# EAGLE design v.0.0.2 (EAGLE 5.08)

## Sheet 1 of 6
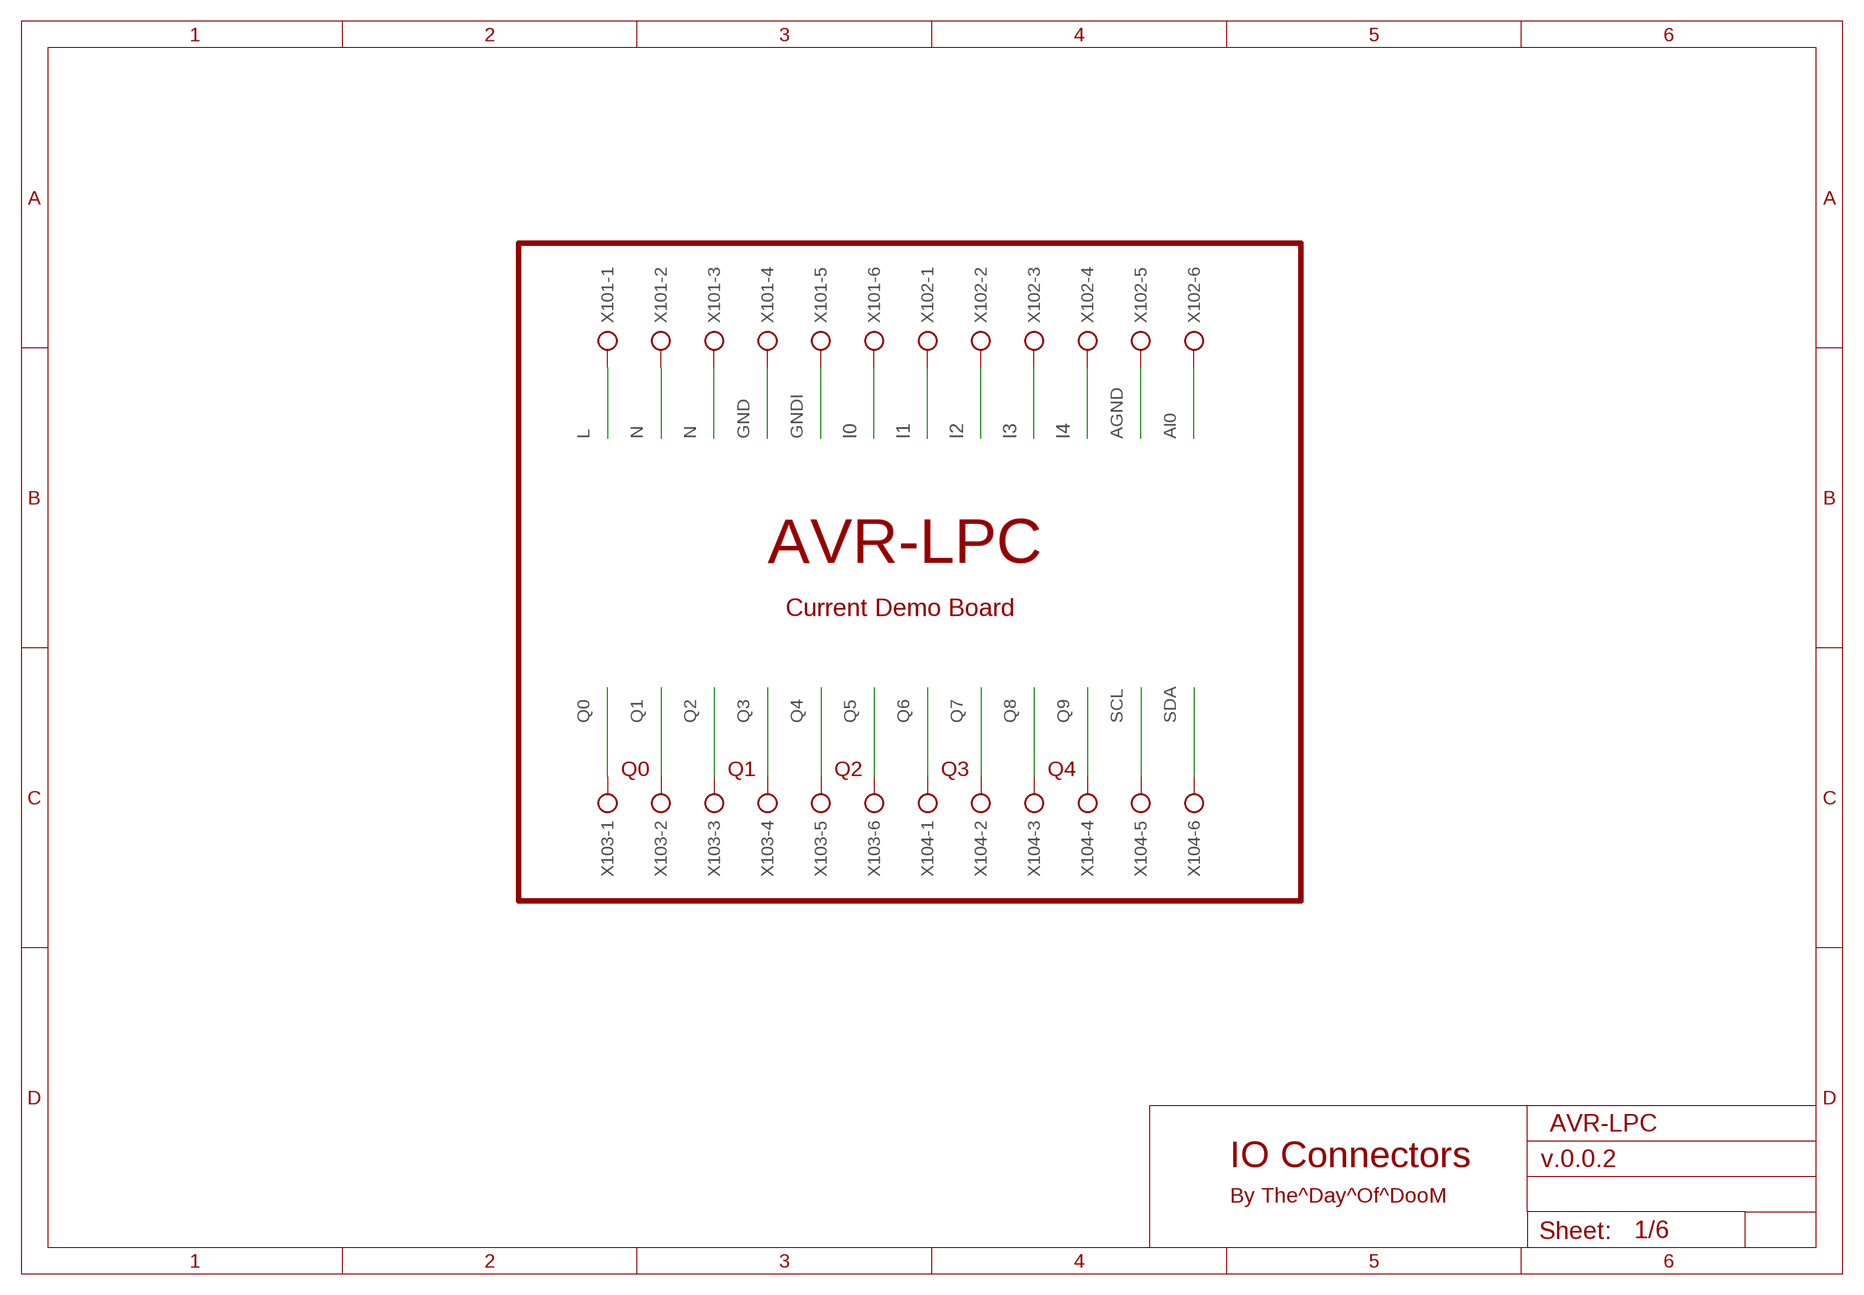
[diagram p0: schematic, sheet 1]

### Parts
X101  AK500/6  [AK500/6]
X102  AK500/6  [AK500/6]
X103  AK500/6  [AK500/6]
X104  AK500/6  [AK500/6]

### Nets
AGND: X102.5 ; also sheet 2,3
AI0: X102.6 ; also sheet 3
GND: X101.4 ; also sheet 2,3,4,5,6
GNDI: X101.5 ; also sheet 2,5
I0: X101.6 ; also sheet 5
I1: X102.1 ; also sheet 5
I2: X102.2 ; also sheet 5
I3: X102.3 ; also sheet 5
I4: X102.4 ; also sheet 5
L: X101.1 ; also sheet 2
N: X101.2 X101.3 ; also sheet 2
Q0: X103.1 ; also sheet 6
Q1: X103.2 ; also sheet 6
Q2: X103.3 ; also sheet 6
Q3: X103.4 ; also sheet 6
Q4: X103.5 ; also sheet 6
Q5: X103.6 ; also sheet 6
Q6: X104.1 ; also sheet 6
Q7: X104.2 ; also sheet 6
Q8: X104.3 ; also sheet 6
Q9: X104.4 ; also sheet 6
SCL: X104.5 ; also sheet 3
SDA: X104.6 ; also sheet 3

### Notes on the sheet
- AVR-LPC
- Current Demo Board
- Q0 | Q1 | Q2 | Q3 | Q4
- AVR-LPC
- IO Connectors
- By The^Day^Of^DooM

## Sheet 2 of 6
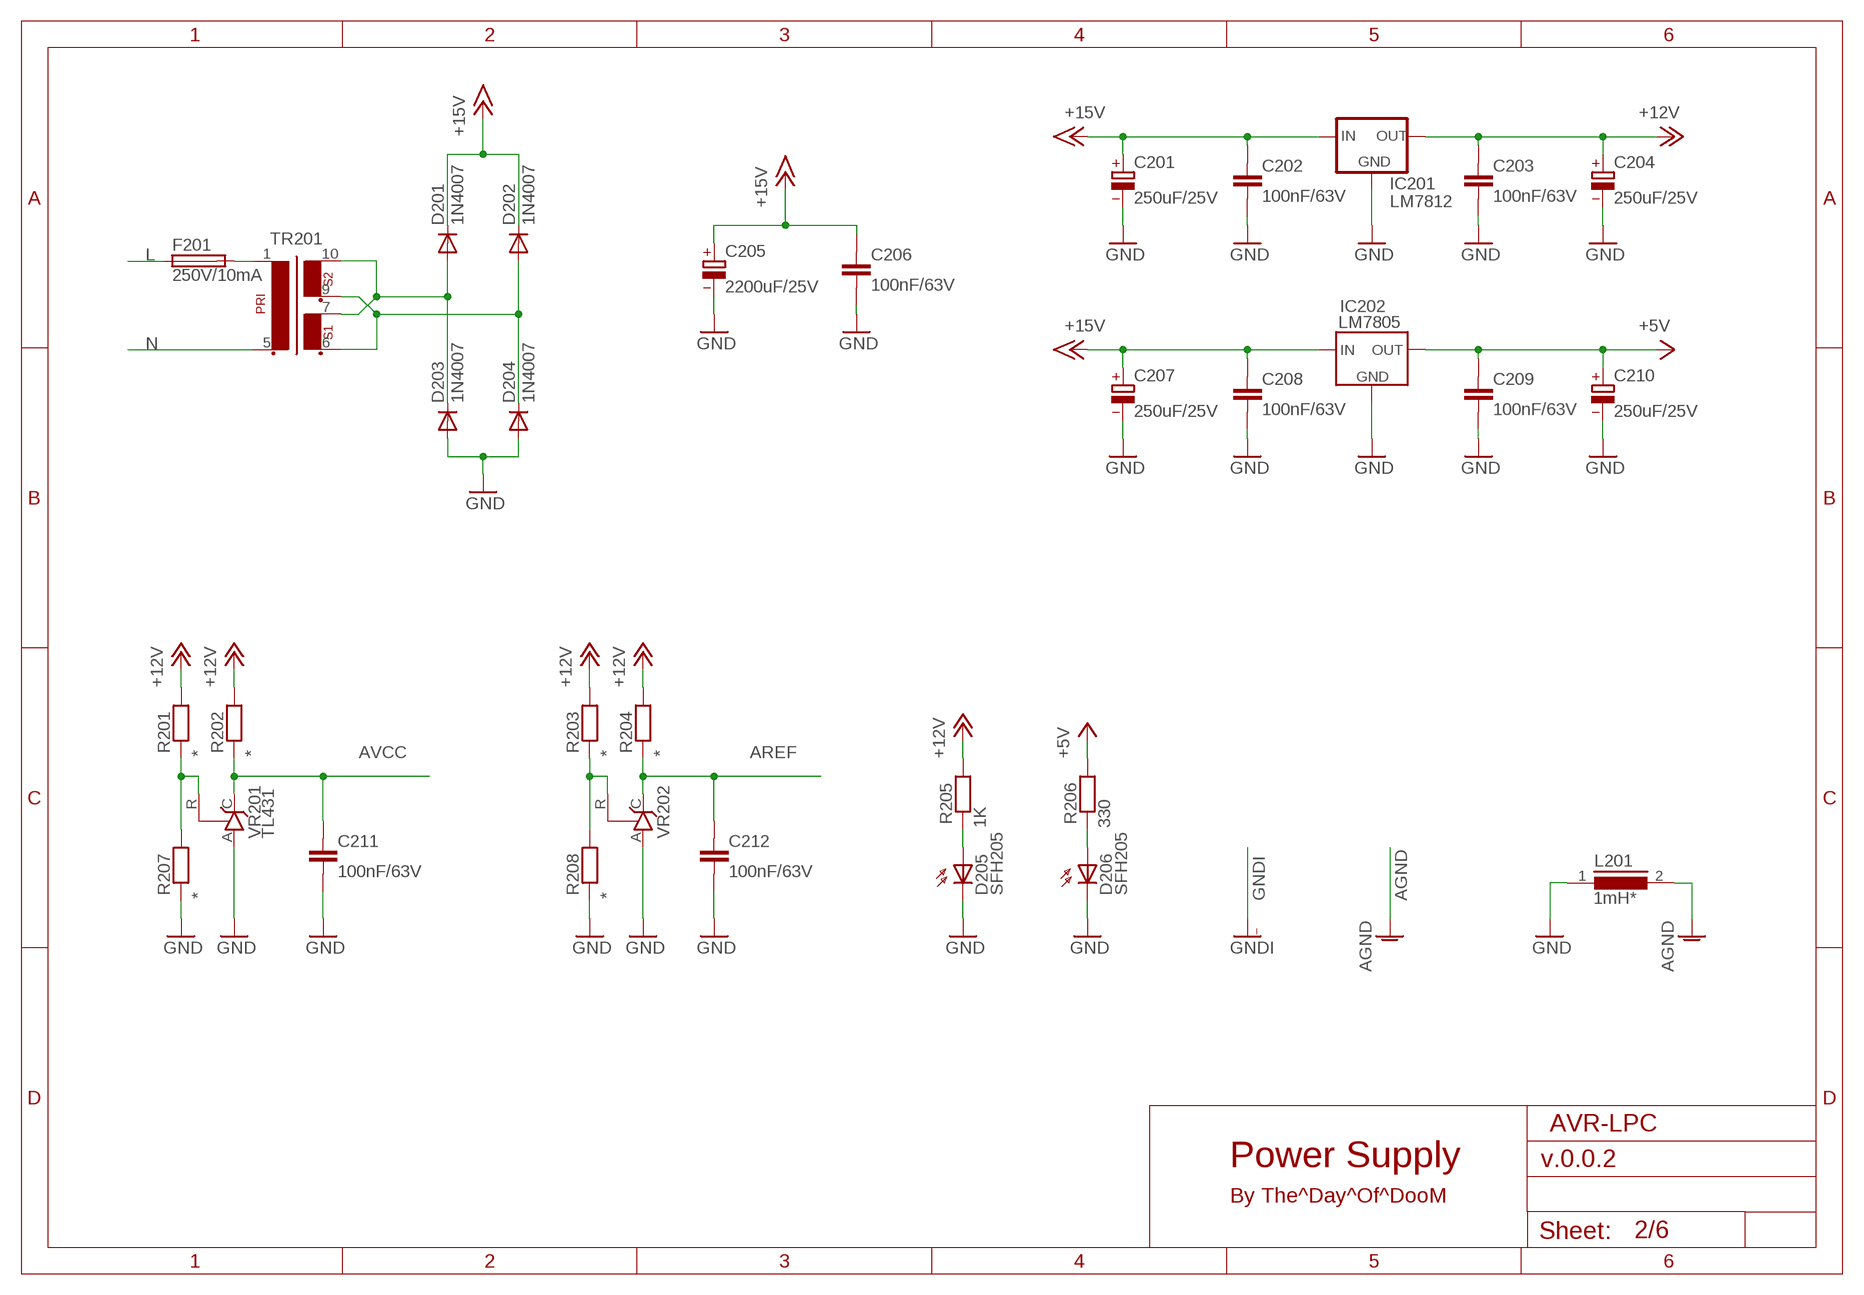
[diagram p1: schematic, sheet 2]

### Parts
C201  250uF/25V  CPOL-EU_Ø250  [CP100X80X24]
C202  100nF/63V  C-EU_2  [C100X86X24]
C203  100nF/63V  C-EU_2  [C100X86X24]
C204  250uF/25V  CPOL-EU_Ø250  [CP100X80X24]
C205  2200uF/25V  CPOL-EU_Ø500Ø400Ø300  [CP500/300X100X24]
C206  100nF/63V  C-EU_3  [C200X100X24]
C207  250uF/25V  CPOL-EU_Ø250  [CP100X80X24]
C208  100nF/63V  C-EU_3  [C200X100X24]
C209  100nF/63V  C-EU_3  [C200X100X24]
C210  250uF/25V  CPOL-EU_Ø250  [CP100X80X24]
C211  100nF/63V  C-EU_3  [C200X100X24]
C212  100nF/63V  C-EU_3  [C200X100X24]
D201  1N4007  1N4007H  [400X100]
D202  1N4007  1N4007H  [400X100]
D203  1N4007  1N4007H  [400X100]
D204  1N4007  1N4007H  [400X100]
D205  SFH205  [SFH205]
D206  SFH205  [SFH205]
F201  250V/10mA  GSH15  [GSH15]
IC201  LM7812  78LXX  [78LXX]
IC202  LM7805  78XXSC1  [78XX_VERTICAL_COOLER]
L201  1mH*  MICC12  [MICC12]
R201  *  R-EU_2  [R100X86X24]
R202  *  R-EU_2  [R100X86X24]
R203  *  R-EU_2  [R100X86X24]
R204  *  R-EU_2  [R100X86X24]
R205  1K  R-EU_3  [R200X86X24]
R206  330  R-EU_3  [R200X86X24]
R207  *  R-EU_2  [R100X86X24]
R208  *  R-EU_2  [R100X86X24]
TR201  EI38-2  [EI38-2]
VR201  TL431  TL431CLP  [TO92-CLP]
VR202  TL431CLP  [TO92-CLP]

### Nets
+5V: C209.P$1 C210.+ IC202.OUT R206.P$2 ; also sheet 3,4,5
+12V: C203.P$1 C204.+ IC201.OUT R201.P$2 R202.P$2 R203.P$2 R204.P$2 R205.P$2 ; also sheet 3
+15V: C201.+ C202.P$1 C205.+ C206.P$1 C207.+ C208.P$1 D201.C D202.C IC201.IN IC202.IN ; also sheet 6
AGND: L201.2 ; also sheet 1,3
AREF: C212.P$1 R204.P$1 VR202.C ; also sheet 3
AVCC: C211.P$1 R202.P$1 VR201.C ; also sheet 3
GND: C201.- C202.P$2 C203.P$2 C204.- C205.- C206.P$2 C207.- C208.P$2 C209.P$2 C210.- C211.P$2 C212.P$2 D203.A D204.A D205.K(C) D206.K(C) IC201.GND IC202.GND L201.1 R207.P$1 R208.P$1 VR201.A VR202.A ; also sheet 1,3,4,5,6
L: F201.1 ; also sheet 1
N: TR201.5 ; also sheet 1
N$1: F201.2 TR201.1
N$3: R201.P$1 R207.P$2 VR201.R
N$5: D202.A D204.C TR201.6 TR201.9
N$6: D201.A D203.C TR201.7 TR201.10
N$7: R203.P$1 R208.P$2 VR202.R
N$20: D205.A R205.P$1
N$34: D206.A R206.P$1

### Notes on the sheet
- AVR-LPC
- Power Supply
- By The^Day^Of^DooM

## Sheet 3 of 6
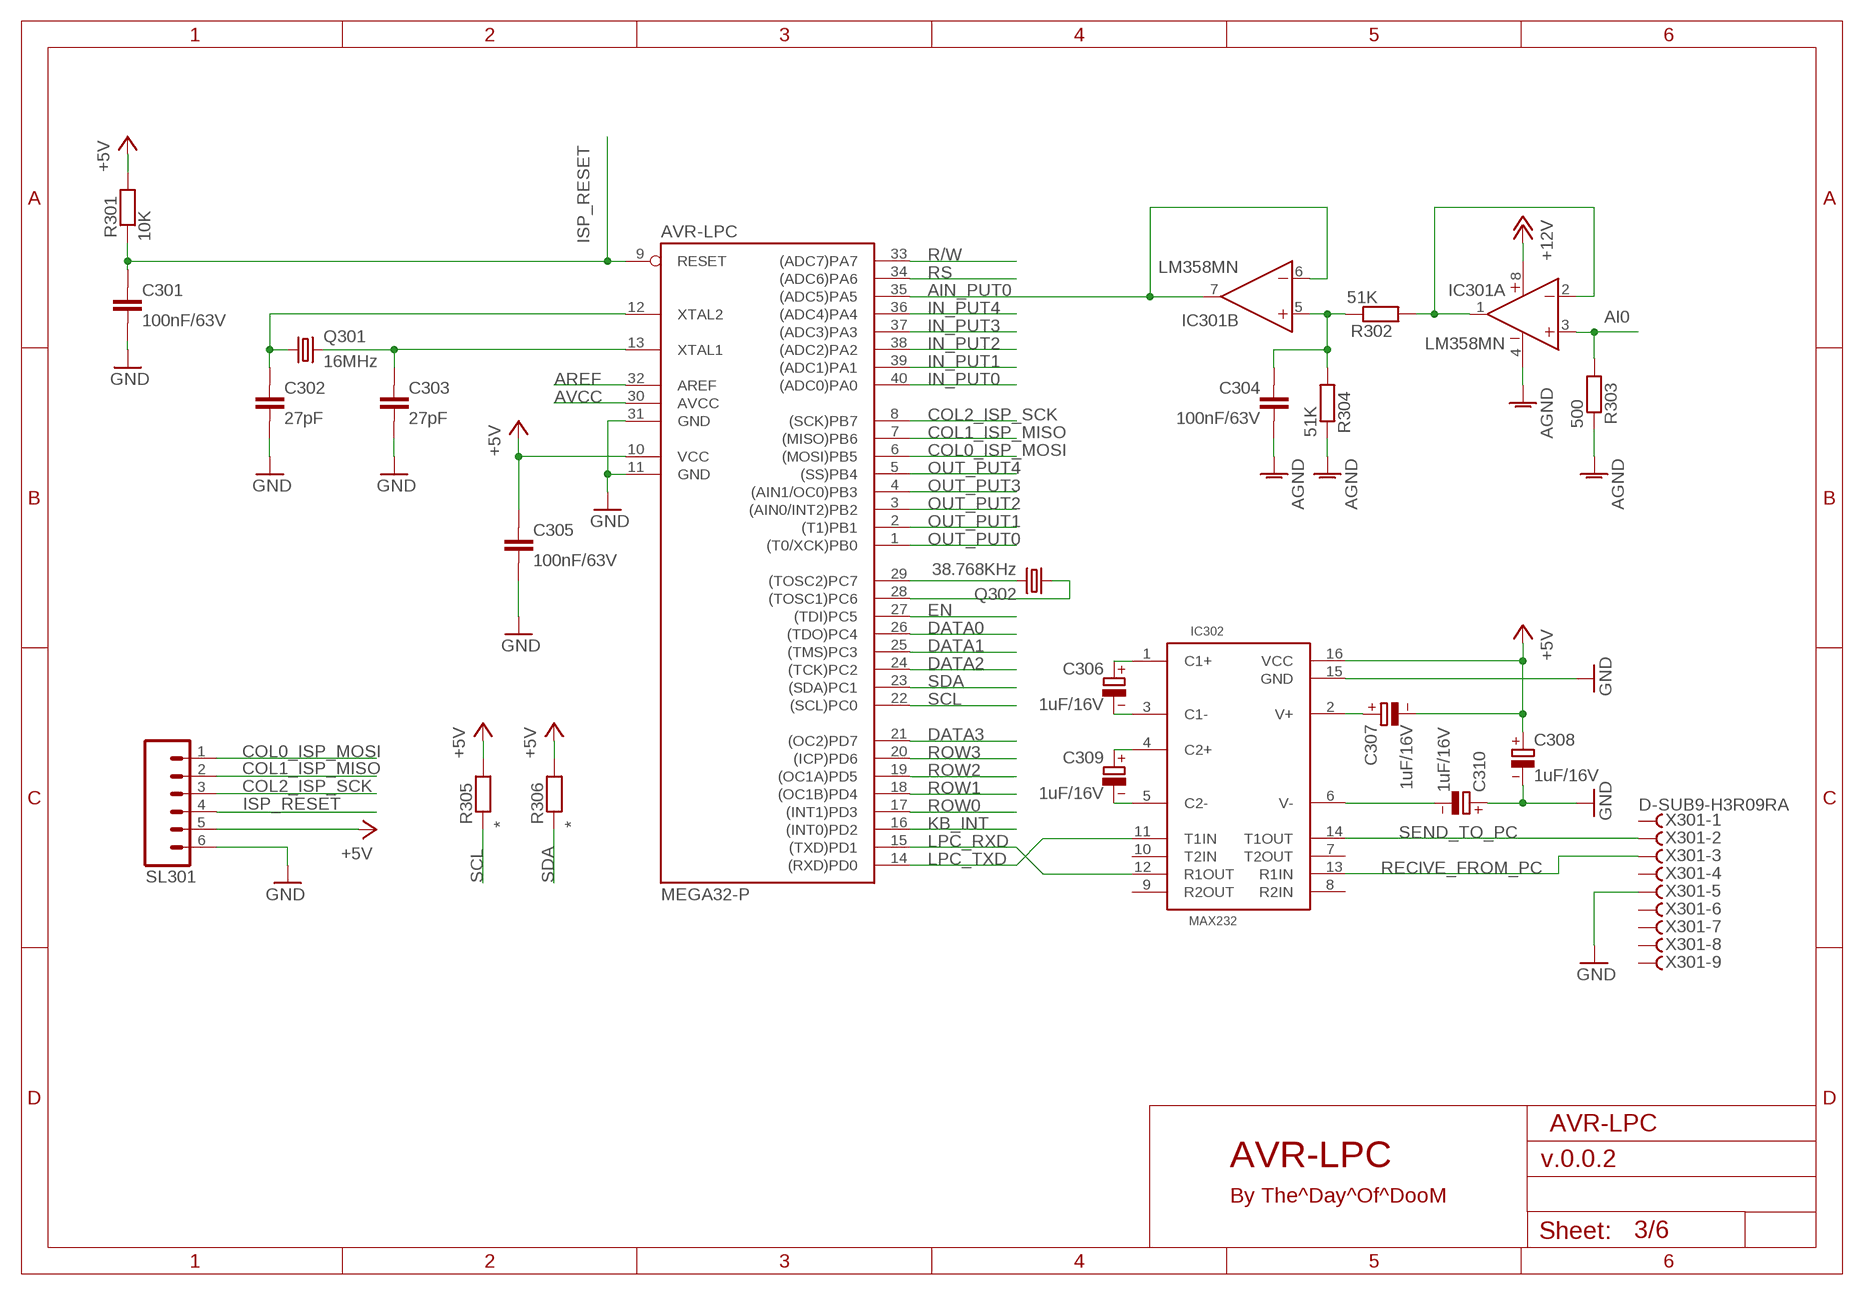
[diagram p2: schematic, sheet 3]

### Parts
AVR-LPC  MEGA32-P  [DIL40]
C301  100nF/63V  C-EU_3  [C200X100X24]
C302  27pF  C-EU_2  [C100X86X24]
C303  27pF  C-EU_2  [C100X86X24]
C304  100nF/63V  C-EU_3  [C200X100X24]
C305  100nF/63V  C-EU_3  [C200X100X24]
C306  1uF/16V  CPOL-EU_Ø250  [CP100X80X24]
C307  1uF/16V  CPOL-EU_Ø250  [CP100X80X24]
C308  1uF/16V  CPOL-EU_Ø250  [CP100X80X24]
C309  1uF/16V  CPOL-EU_Ø250  [CP100X80X24]
C310  1uF/16V  CPOL-EU_Ø250  [CP100X80X24]
IC301  LM358MN  [DIL8]
IC302  MAX232  [DIL16]
Q301  16MHz  CRYSTALHC49U-V  [HC49U-V]
Q302  38.768KHz  CRYSTALTC26V  [TC26V]
R301  10K  R-EU_2  [R100X86X24]
R302  51K  R-EU_5  [R300X100X24]
R303  500  R-EU_2  [R100X86X24]
R304  51K  R-EU_5  [R300X100X24]
R305  *  R-EU_6  [R400X100X24]
R306  *  R-EU_6  [R400X100X24]
SL301  M06  [06P]
X301  D-SUB9-H3R09RA  [H3R09RA]

### Nets
+5V: AVR-LPC.10(VCC) C305.P$1 C307.- C308.+ IC302.16(VCC) R301.P$2 R305.P$2 R306.P$2 SL301.5 ; also sheet 2,4,5
+12V: IC301.8(A:V+) ; also sheet 2
AGND: C304.P$2 IC301.4(A:V-) R303.P$1 R304.P$1 ; also sheet 1,2
AI0: IC301.3(A:IN+) R303.P$2 ; also sheet 1
AIN_PUT0: AVR-LPC.35((ADC5)PA5) IC301.6(B:-IN) IC301.7(B:OUT)
AREF: AVR-LPC.32(AREF) ; also sheet 2
AVCC: AVR-LPC.30(AVCC) ; also sheet 2
COL0_ISP_MOSI: AVR-LPC.6((MOSI)PB5) SL301.1 ; also sheet 4
COL1_ISP_MISO: AVR-LPC.7((MISO)PB6) SL301.2 ; also sheet 4
COL2_ISP_SCK: AVR-LPC.8((SCK)PB7) SL301.3 ; also sheet 4
DATA0: AVR-LPC.26((TDO)PC4) ; also sheet 4
DATA1: AVR-LPC.25((TMS)PC3) ; also sheet 4
DATA2: AVR-LPC.24((TCK)PC2) ; also sheet 4
DATA3: AVR-LPC.21((OC2)PD7) ; also sheet 4
EN: AVR-LPC.27((TDI)PC5) ; also sheet 4
GND: AVR-LPC.11(GND) AVR-LPC.31(GND) C301.P$2 C302.P$2 C303.P$2 C305.P$2 C308.- C310.+ IC302.15(GND) SL301.6 X301.5 ; also sheet 1,2,4,5,6
IN_PUT0: AVR-LPC.40((ADC0)PA0) ; also sheet 5
IN_PUT1: AVR-LPC.39((ADC1)PA1) ; also sheet 5
IN_PUT2: AVR-LPC.38((ADC2)PA2) ; also sheet 5
IN_PUT3: AVR-LPC.37((ADC3)PA3) ; also sheet 5
IN_PUT4: AVR-LPC.36((ADC4)PA4) ; also sheet 5
ISP_RESET: AVR-LPC.9(RESET) C301.P$1 R301.P$1 SL301.4
KB_INT: AVR-LPC.16((INT0)PD2) ; also sheet 4
LPC_RXD: AVR-LPC.15((TXD)PD1) IC302.12(R1OUT)
LPC_TXD: AVR-LPC.14((RXD)PD0) IC302.11(T1IN)
N$4: C306.- IC302.3(C1-)
N$9: C306.+ IC302.1(C1+)
N$10: AVR-LPC.12(XTAL2) C302.P$1 Q301.1
N$11: AVR-LPC.13(XTAL1) C303.P$1 Q301.2
N$12: C309.- IC302.5(C2-)
N$13: C309.+ IC302.4(C2+)
N$14: C307.+ IC302.2(V+)
N$15: AVR-LPC.28((TOSC1)PC6) Q302.1
N$16: AVR-LPC.29((TOSC2)PC7) Q302.2
N$17: C304.P$1 IC301.5(B:IN+) R302.P$1 R304.P$2
N$19: C310.- IC302.6(V-)
N$29: IC301.1(A:OUT) IC301.2(A:IN-) R302.P$2
OUT_PUT0: AVR-LPC.1((T0/XCK)PB0) ; also sheet 6
OUT_PUT1: AVR-LPC.2((T1)PB1) ; also sheet 6
OUT_PUT2: AVR-LPC.3((AIN0/INT2)PB2) ; also sheet 6
OUT_PUT3: AVR-LPC.4((AIN1/OC0)PB3) ; also sheet 6
OUT_PUT4: AVR-LPC.5((SS)PB4) ; also sheet 6
R/W: AVR-LPC.33((ADC7)PA7) ; also sheet 4
RECIVE_FROM_PC: IC302.13(R1IN) X301.3
ROW0: AVR-LPC.17((INT1)PD3) ; also sheet 4
ROW1: AVR-LPC.18((OC1B)PD4) ; also sheet 4
ROW2: AVR-LPC.19((OC1A)PD5) ; also sheet 4
ROW3: AVR-LPC.20((ICP)PD6) ; also sheet 4
RS: AVR-LPC.34((ADC6)PA6) ; also sheet 4
SCL: AVR-LPC.22((SCL)PC0) R305.P$1 ; also sheet 1
SDA: AVR-LPC.23((SDA)PC1) R306.P$1 ; also sheet 1
SEND_TO_PC: IC302.14(T1OUT) X301.2
Unconnected: IC302.7(T2OUT) IC302.8(R2IN) IC302.9(R2OUT) IC302.10(T2IN) X301.1 X301.4 X301.6 X301.7 X301.8 X301.9

### Notes on the sheet
- AVR-LPC
- AVR-LPC
- By The^Day^Of^DooM

## Sheet 4 of 6
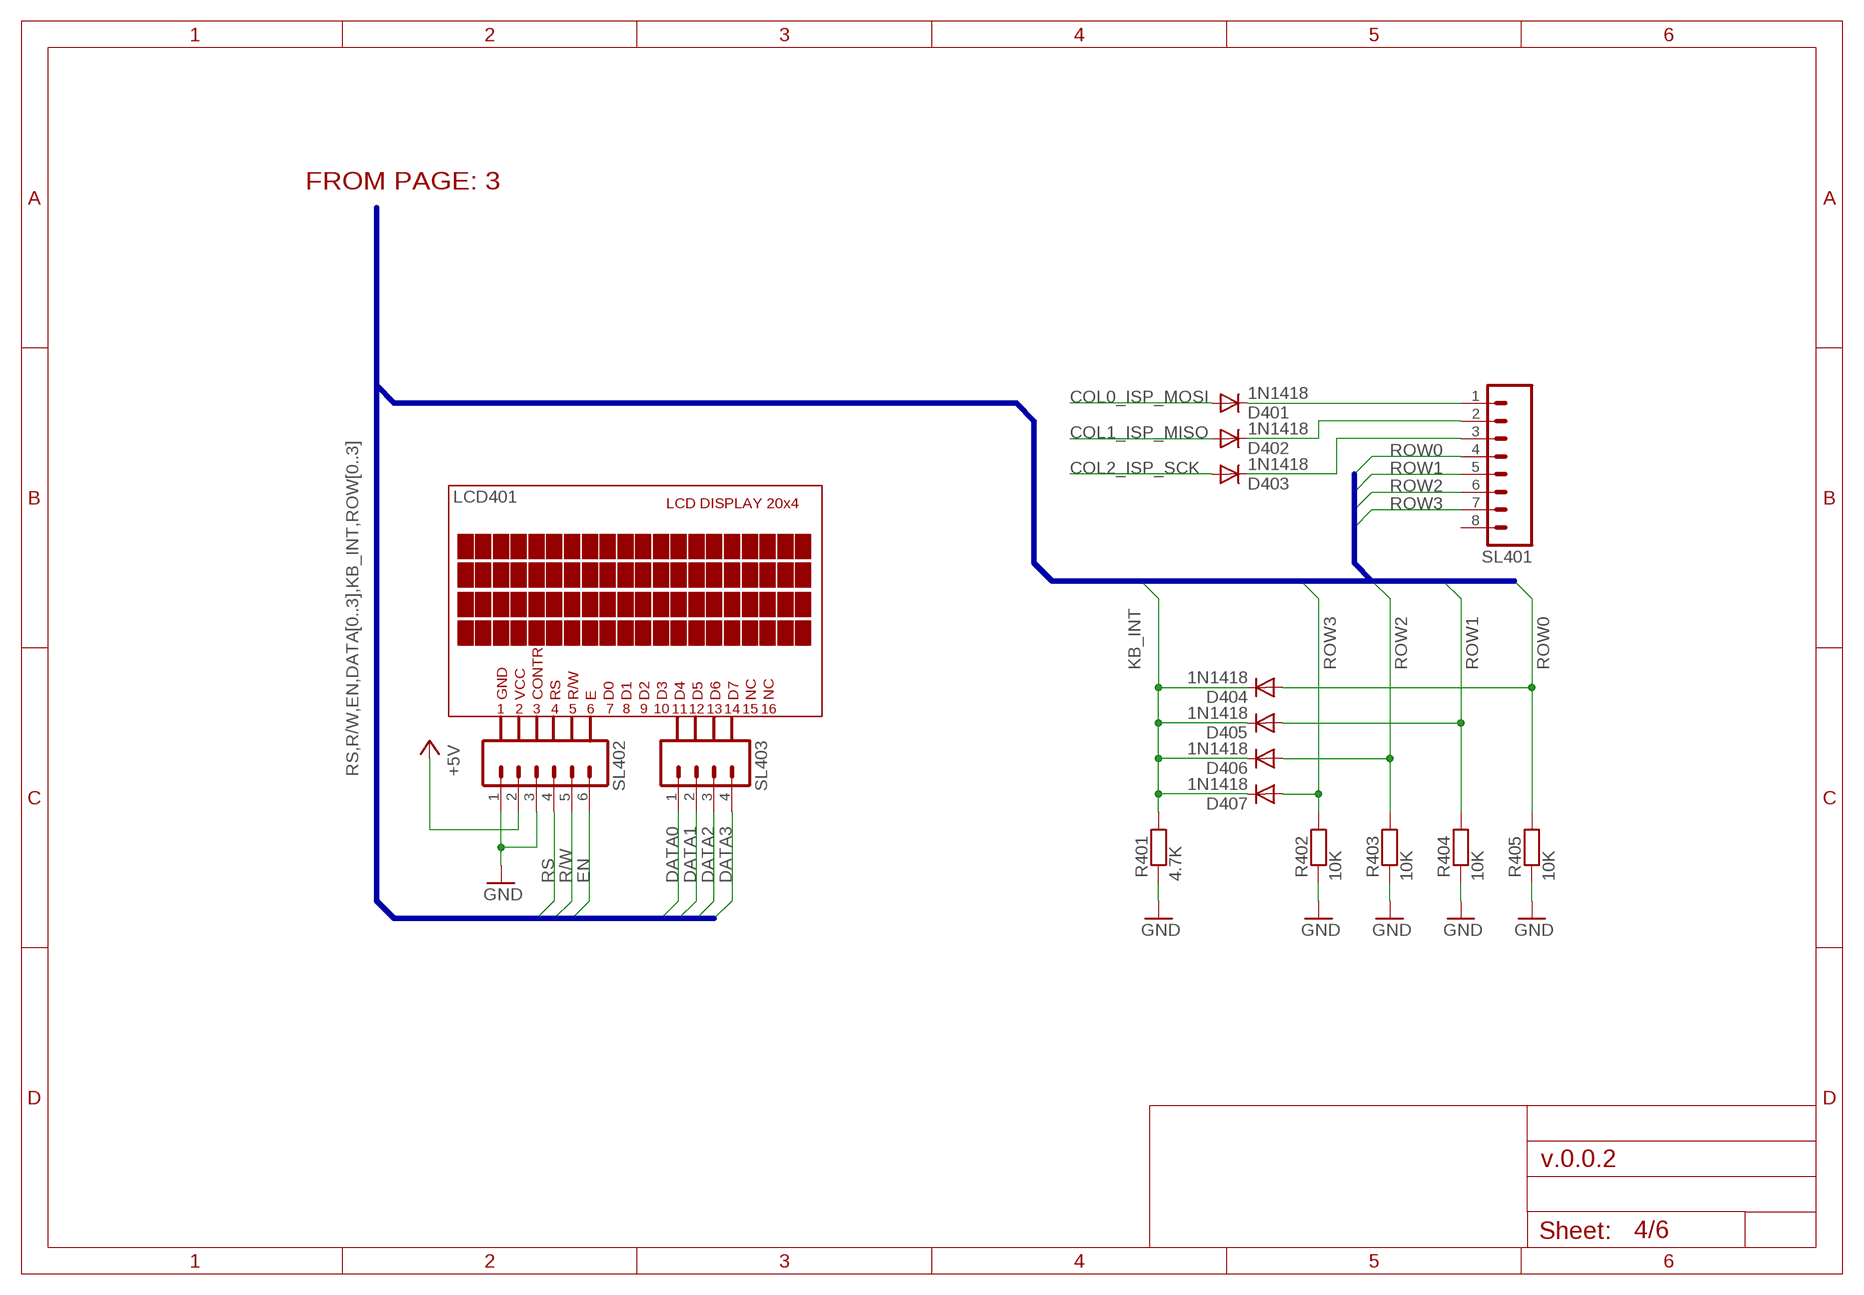
[diagram p3: schematic, sheet 4]

### Parts
D401  1N1418  DIODE-D-5  [D-5]
D402  1N1418  DIODE-D-5  [D-5]
D403  1N1418  DIODE-D-5  [D-5]
D404  1N1418  DIODE-D-2.5  [D-2.5]
D405  1N1418  DIODE-D-2.5  [D-2.5]
D406  1N1418  DIODE-D-2.5  [D-2.5]
D407  1N1418  DIODE-D-2.5  [D-2.5]
LCD401  JM204_SIZESIZE  [JM20X4]
R401  4.7K  R-EU_9  [R300X86X24]
R402  10K  R-EU_10  [R350X86X24]
R403  10K  R-EU_10  [R350X86X24]
R404  10K  R-EU_10  [R350X86X24]
R405  10K  R-EU_10  [R350X86X24]
SL401  M08  [08P]
SL402  M06  [06P]
SL403  M04  [04P]

### Nets
+5V: SL402.2 ; also sheet 2,3,5
COL0_ISP_MOSI: D401.A ; also sheet 3
COL1_ISP_MISO: D402.A ; also sheet 3
COL2_ISP_SCK: D403.A ; also sheet 3
DATA0: SL403.1 ; also sheet 3
DATA1: SL403.2 ; also sheet 3
DATA2: SL403.3 ; also sheet 3
DATA3: SL403.4 ; also sheet 3
EN: SL402.6 ; also sheet 3
GND: R401.P$1 R402.P$1 R403.P$1 R404.P$1 R405.P$1 SL402.1 SL402.3 ; also sheet 1,2,3,5,6
KB_INT: D404.C D405.C D406.C D407.C R401.P$2 ; also sheet 3
N$24: D401.C SL401.1
N$25: D402.C SL401.2
N$28: D403.C SL401.3
R/W: SL402.5 ; also sheet 3
ROW0: D404.A R405.P$2 SL401.4 ; also sheet 3
ROW1: D405.A R404.P$2 SL401.5 ; also sheet 3
ROW2: D406.A R403.P$2 SL401.6 ; also sheet 3
ROW3: D407.A R402.P$2 SL401.7 ; also sheet 3
RS: SL402.4 ; also sheet 3
Unconnected: SL401.8

### Buses
RS,R/W,EN,DATA[0..3],KB_INT,ROW[0..3]
KB_INT,ROW[0..3]

### Notes on the sheet
- FROM PAGE: 3

## Sheet 5 of 6
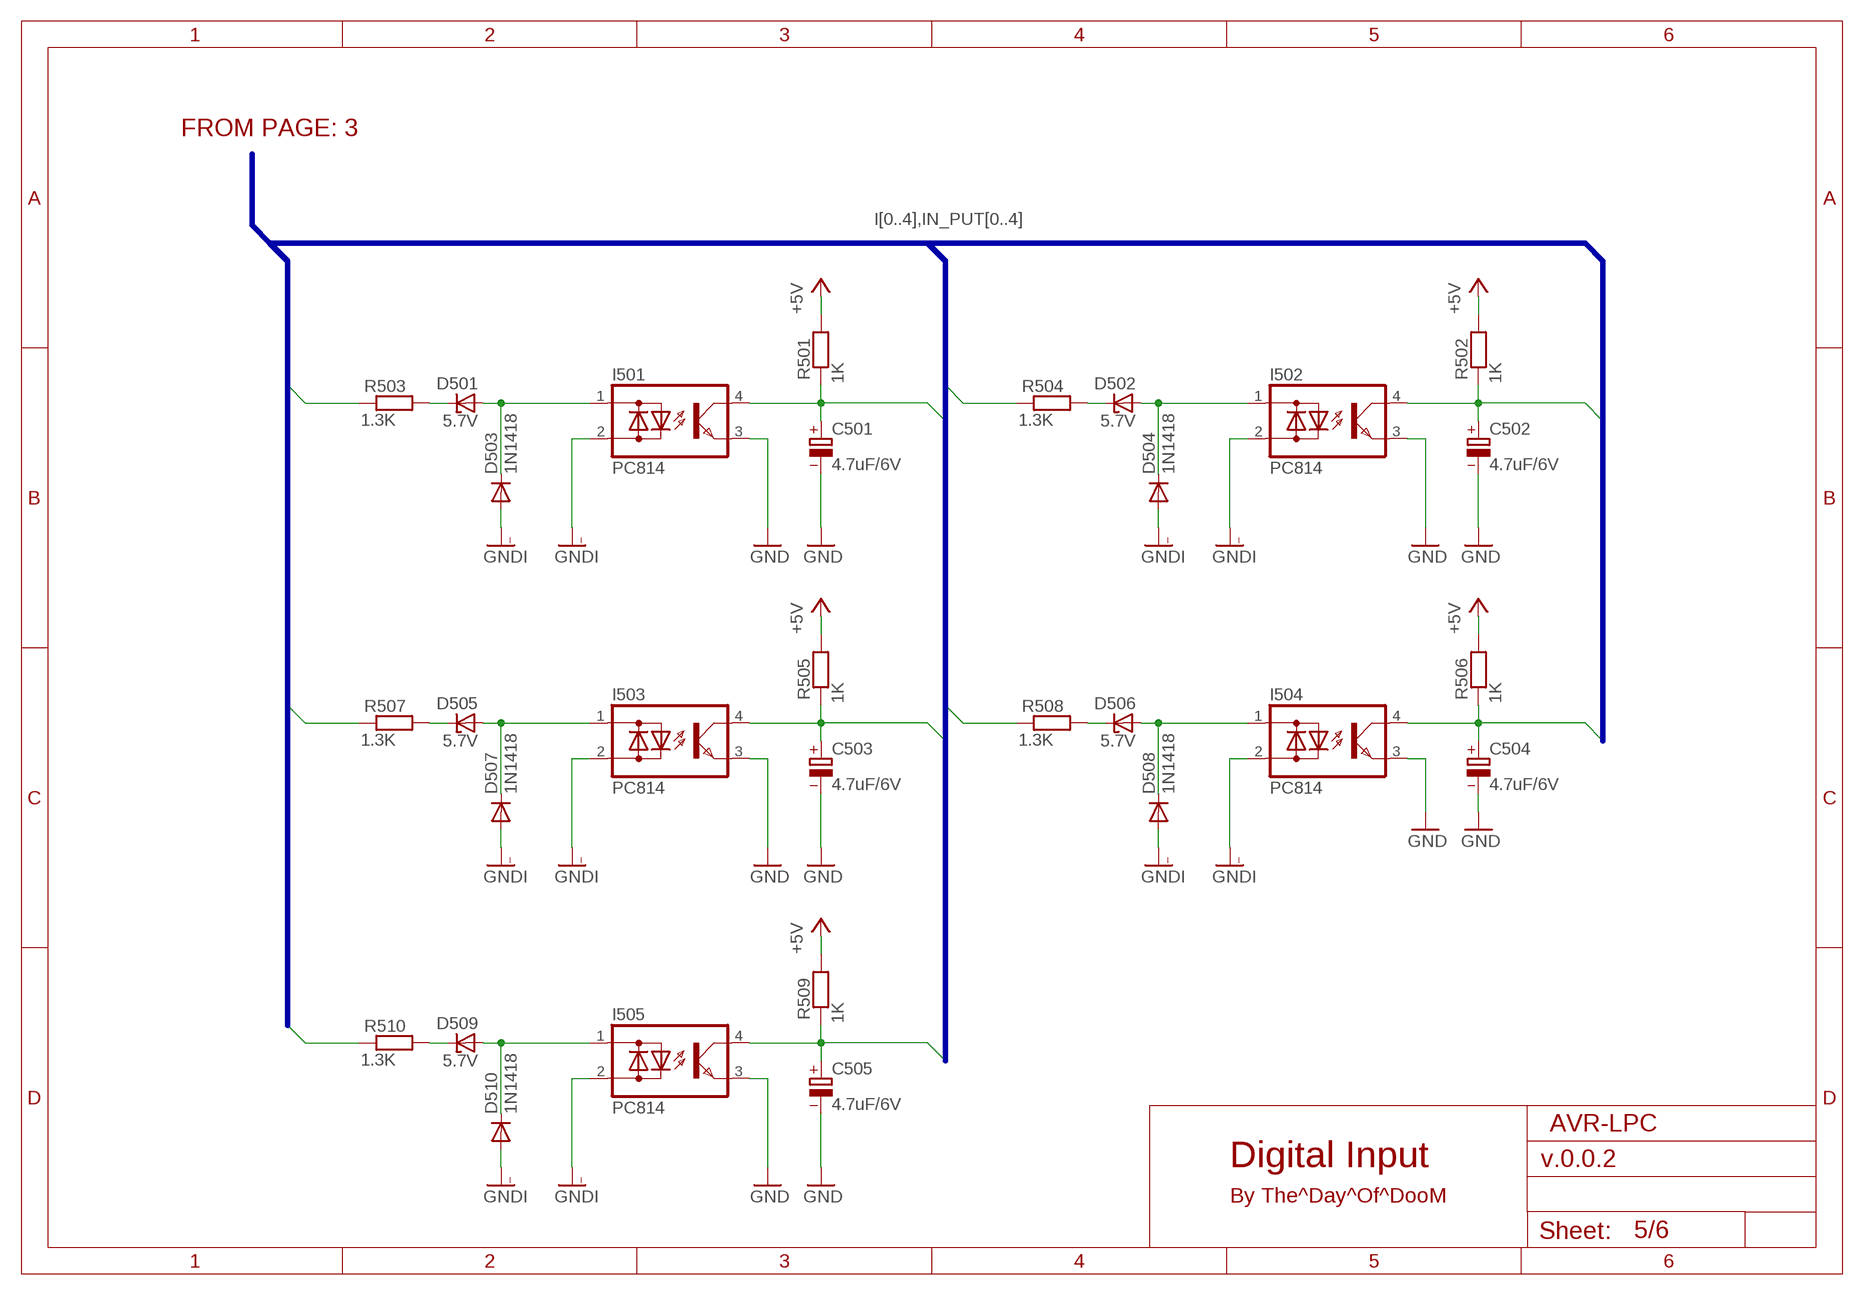
[diagram p4: schematic, sheet 5]

### Parts
C501  4.7uF/6V  CPOL-EU_Ø250  [CP100X80X24]
C502  4.7uF/6V  CPOL-EU_Ø250  [CP100X80X24]
C503  4.7uF/6V  CPOL-EU_Ø250  [CP100X80X24]
C504  4.7uF/6V  CPOL-EU_Ø250  [CP100X80X24]
C505  4.7uF/6V  CPOL-EU_Ø250  [CP100X80X24]
D501  5.7V  ZENER-DIODEZD-2.5  [ZDIO-2.5]
D502  5.7V  ZENER-DIODEZD-2.5  [ZDIO-2.5]
D503  1N1418  DIODE-D-2.5  [D-2.5]
D504  1N1418  DIODE-D-2.5  [D-2.5]
D505  5.7V  ZENER-DIODEZD-2.5  [ZDIO-2.5]
D506  5.7V  ZENER-DIODEZD-2.5  [ZDIO-2.5]
D507  1N1418  DIODE-D-2.5  [D-2.5]
D508  1N1418  DIODE-D-2.5  [D-2.5]
D509  5.7V  ZENER-DIODEZD-2.5  [ZDIO-2.5]
D510  1N1418  DIODE-D-2.5  [D-2.5]
I501  PC814  [DIL04]
I502  PC814  [DIL04]
I503  PC814  [DIL04]
I504  PC814  [DIL04]
I505  PC814  [DIL04]
R501  1K  R-EU_8  [R500X86X24]
R502  1K  R-EU_8  [R500X86X24]
R503  1.3K  R-EU_2  [R100X86X24]
R504  1.3K  R-EU_2  [R100X86X24]
R505  1K  R-EU_8  [R500X86X24]
R506  1K  R-EU_8  [R500X86X24]
R507  1.3K  R-EU_2  [R100X86X24]
R508  1.3K  R-EU_2  [R100X86X24]
R509  1K  R-EU_8  [R500X86X24]
R510  1.3K  R-EU_2  [R100X86X24]

### Nets
+5V: R501.P$2 R502.P$2 R505.P$2 R506.P$2 R509.P$2 ; also sheet 2,3,4
GND: C501.- C502.- C503.- C504.- C505.- I501.3(E) I502.3(E) I503.3(E) I504.3(E) I505.3(E) ; also sheet 1,2,3,4,6
GNDI: D503.A D504.A D507.A D508.A D510.A I501.2(AC2) I502.2(AC2) I503.2(AC2) I504.2(AC2) I505.2(AC2) ; also sheet 1,2
I0: R503.P$1 ; also sheet 1
I1: R504.P$1 ; also sheet 1
I2: R507.P$1 ; also sheet 1
I3: R508.P$1 ; also sheet 1
I4: R510.P$1 ; also sheet 1
IN_PUT0: C501.+ I501.4(C) R501.P$1 ; also sheet 3
IN_PUT1: C502.+ I502.4(C) R502.P$1 ; also sheet 3
IN_PUT2: C503.+ I503.4(C) R505.P$1 ; also sheet 3
IN_PUT3: C504.+ I504.4(C) R506.P$1 ; also sheet 3
IN_PUT4: C505.+ I505.4(C) R509.P$1 ; also sheet 3
N$22: D501.C R503.P$2
N$23: D501.A D503.C I501.1(AC1)
N$26: D505.C R507.P$2
N$27: D505.A D507.C I503.1(AC1)
N$39: D509.C R510.P$2
N$40: D509.A D510.C I505.1(AC1)
N$43: D502.C R504.P$2
N$44: D502.A D504.C I502.1(AC1)
N$51: D506.C R508.P$2
N$52: D506.A D508.C I504.1(AC1)

### Buses
I[0..4],IN_PUT[0..4]

### Notes on the sheet
- FROM PAGE: 3
- AVR-LPC
- Digital Input
- By The^Day^Of^DooM

## Sheet 6 of 6
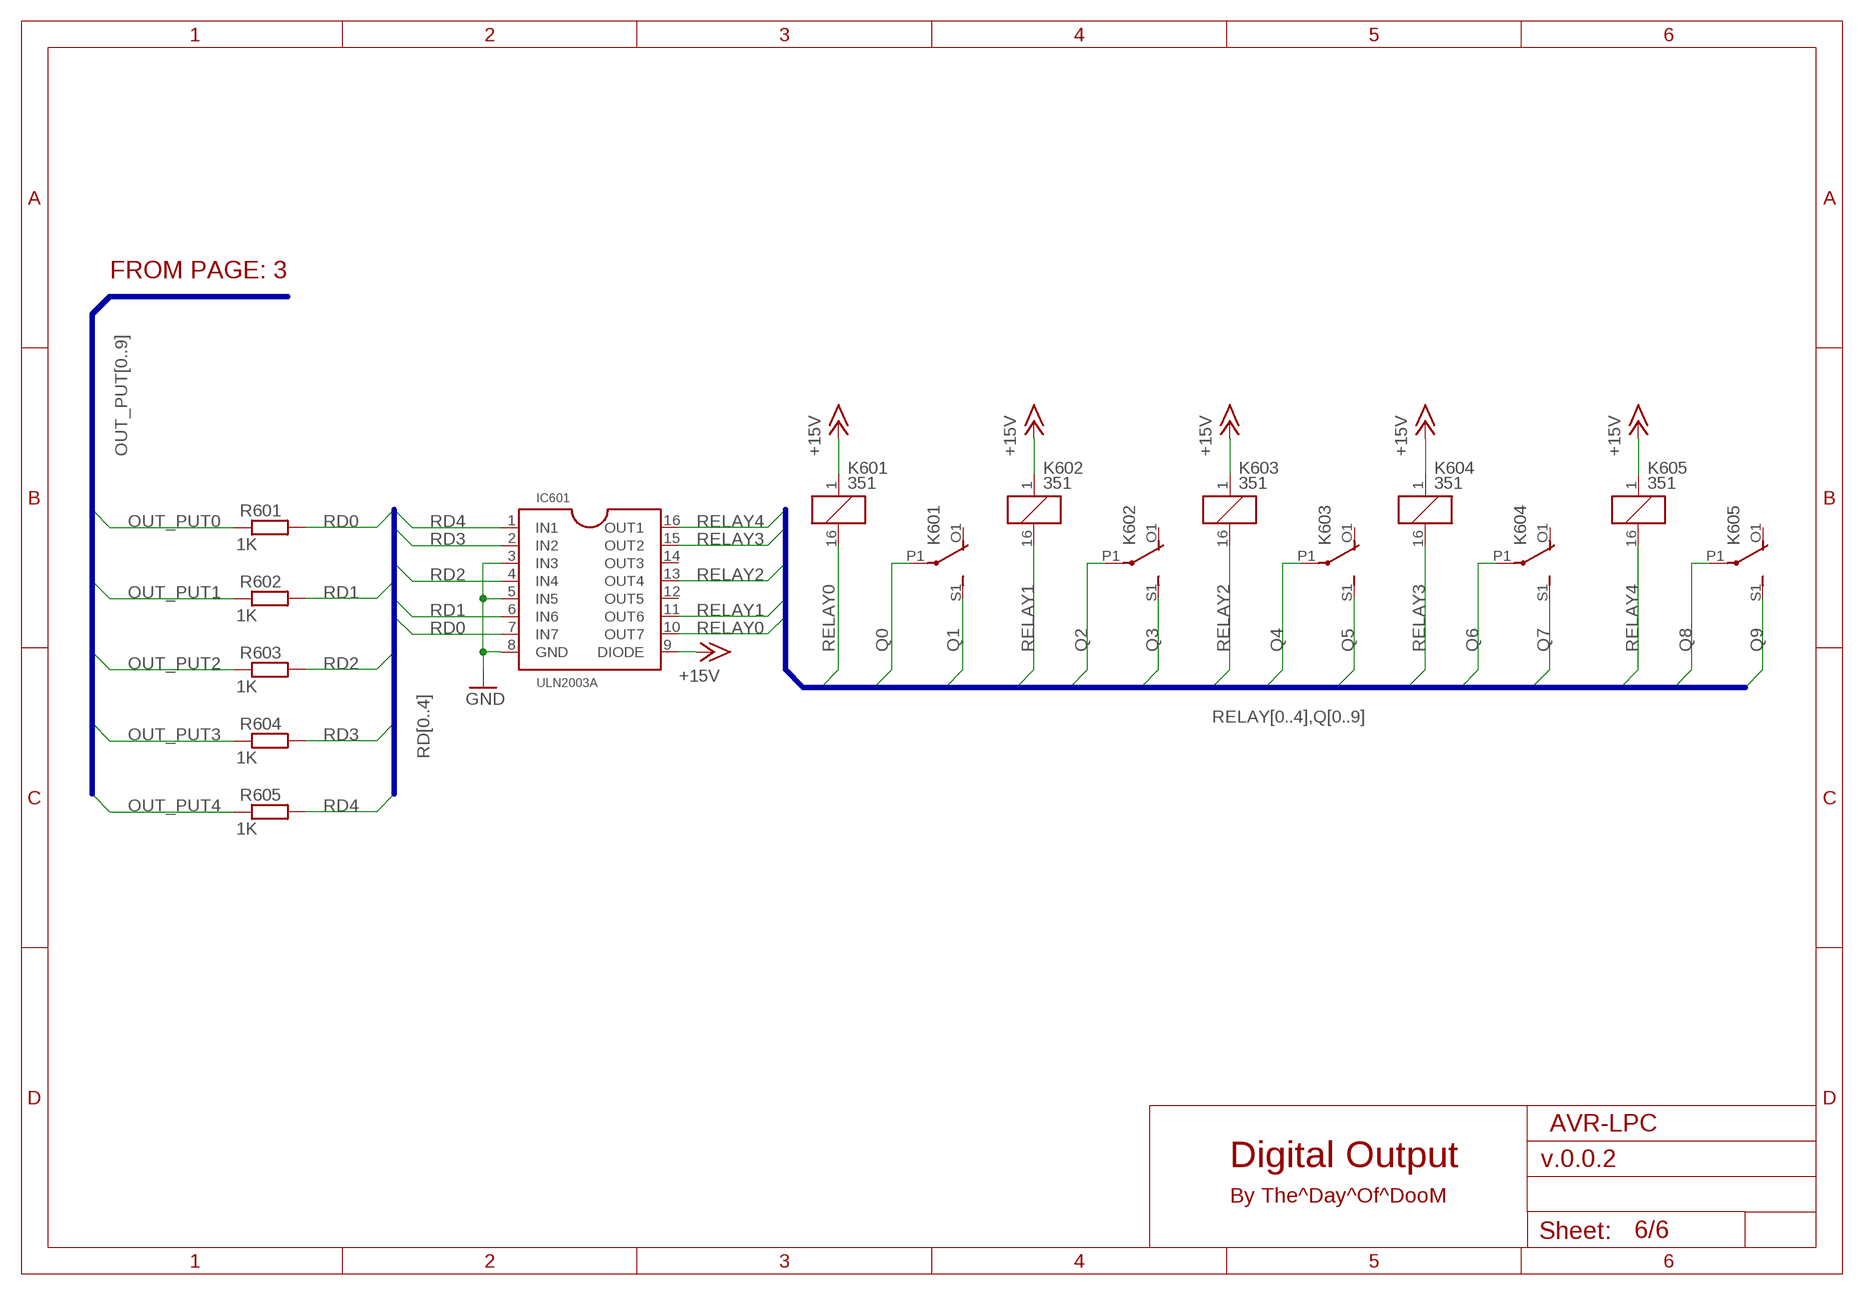
[diagram p5: schematic, sheet 6]

### Parts
IC601  ULN2003A  [DIL16]
K601  351  [351]
K602  351  [351]
K603  351  [351]
K604  351  [351]
K605  351  [351]
R601  1K  R-EU_1  [R100X80X24]
R602  1K  R-EU_1  [R100X80X24]
R603  1K  R-EU_1  [R100X80X24]
R604  1K  R-EU_1  [R100X80X24]
R605  1K  R-EU_1  [R100X80X24]

### Nets
+15V: IC601.9(DIODE) K601.1 K602.1 K603.1 K604.1 K605.1 ; also sheet 2
GND: IC601.3(IN3) IC601.5(IN5) IC601.8(GND) ; also sheet 1,2,3,4,5
OUT_PUT0: R601.P$1 ; also sheet 3
OUT_PUT1: R602.P$1 ; also sheet 3
OUT_PUT2: R603.P$1 ; also sheet 3
OUT_PUT3: R604.P$1 ; also sheet 3
OUT_PUT4: R605.P$1 ; also sheet 3
Q0: K601.P1(2:P) ; also sheet 1
Q1: K601.S1(2:S) ; also sheet 1
Q2: K602.P1(2:P) ; also sheet 1
Q3: K602.S1(2:S) ; also sheet 1
Q4: K603.P1(2:P) ; also sheet 1
Q5: K603.S1(2:S) ; also sheet 1
Q6: K604.P1(2:P) ; also sheet 1
Q7: K604.S1(2:S) ; also sheet 1
Q8: K605.P1(2:P) ; also sheet 1
Q9: K605.S1(2:S) ; also sheet 1
RD0: IC601.7(IN7) R601.P$2
RD1: IC601.6(IN6) R602.P$2
RD2: IC601.4(IN4) R603.P$2
RD3: IC601.2(IN2) R604.P$2
RD4: IC601.1(IN1) R605.P$2
RELAY0: IC601.10(OUT7) K601.16
RELAY1: IC601.11(OUT6) K602.16
RELAY2: IC601.13(OUT4) K603.16
RELAY3: IC601.15(OUT2) K604.16
RELAY4: IC601.16(OUT1) K605.16
Unconnected: IC601.12(OUT5) IC601.14(OUT3) K601.O1(2:O) K601.O2(3:O) K601.P2(3:P) K601.S2(3:S) K602.O1(2:O) K602.O2(3:O) K602.P2(3:P) K602.S2(3:S) K603.O1(2:O) K603.O2(3:O) K603.P2(3:P) K603.S2(3:S) K604.O1(2:O) K604.O2(3:O) K604.P2(3:P) K604.S2(3:S) K605.O1(2:O) K605.O2(3:O) K605.P2(3:P) K605.S2(3:S)

### Buses
RD[0..4]
OUT_PUT[0..9]
RELAY[0..4],Q[0..9]

### Notes on the sheet
- FROM PAGE: 3
- AVR-LPC
- Digital Output
- By The^Day^Of^DooM

## Library data of the parts
AVR-LPC = atmel:MEGA32-P: MICROCONTROLLER 32 Kbytes FLASH 2 Kbytes SRAM 1 Kbytes EEPROM USART 8-channel 10 bit ADC Source: www.atmel.com .. doc2503.pdf
C201 C204 C205 C207 C210 C306-C310 C501-C505 = myRcl:CPOL-EU_
C202 C203 C206 C208 C209 C211 C212 C301-C305 = myRcl:C-EU_: CAPACITOR, European symbol
D201-D204 = diode:1N4007
D205 D206 = opto-trans-siemens:SFH205: PHOTO DIODE
D401-D407 D503 D504 D507 D508 D510 = diode:DIODE-: DIODE
D501 D502 D505 D506 D509 = diode:ZENER-DIODE: Z-Diode
F201 = fuse:GSH15: FUSE HOLDER grid 15mm, 19649 Wickmann
I501-I505 = optocoupler:PC814: SHARP OPTO COUPLER
IC201 = v-reg:78LXX: VOLTAGE REGULATOR
IC202 = myV-reg:78XXSC: VOLTAGE REGULATOR
IC301 = myLinear:LM358M
IC302 = myMaxim:MAX232
IC601 = myLinear:ULN2003A
K601-K605 = relay:351: RELAY 2 x switch, Omron
L201 = inductors:MICC12: INDUCTOR
LCD401 = display-lcd:JM204_SIZE: LCD: JM204
Q301 Q302 = crystal:CRYSTAL: CRYSTAL
R201-R208 R301-R306 R401-R405 R501-R510 R601-R605 = myRcl:R-EU_: RESISTOR, European symbol
SL301 SL402 = con-amp-quick:M06: AMP QUICK CONNECTOR
SL401 = con-amp-quick:M08: AMP QUICK CONNECTOR
SL403 = con-amp-quick:M04: AMP QUICK CONNECTOR
TR201 = trafo:EI38-2: TRANSFORMER 1 primary winding, 2 secondary windings ERA
VR201 VR202 = v-reg:TL431CLP: VOLTAGE REGULATOR
X101-X104 = con-ptr500:AK500/6: CONNECTOR
X301 = con-thomas-betts:D-SUB9-: D-Subminiatur Connector Source: Electronioc Interconnects European Edition 1998

## Board
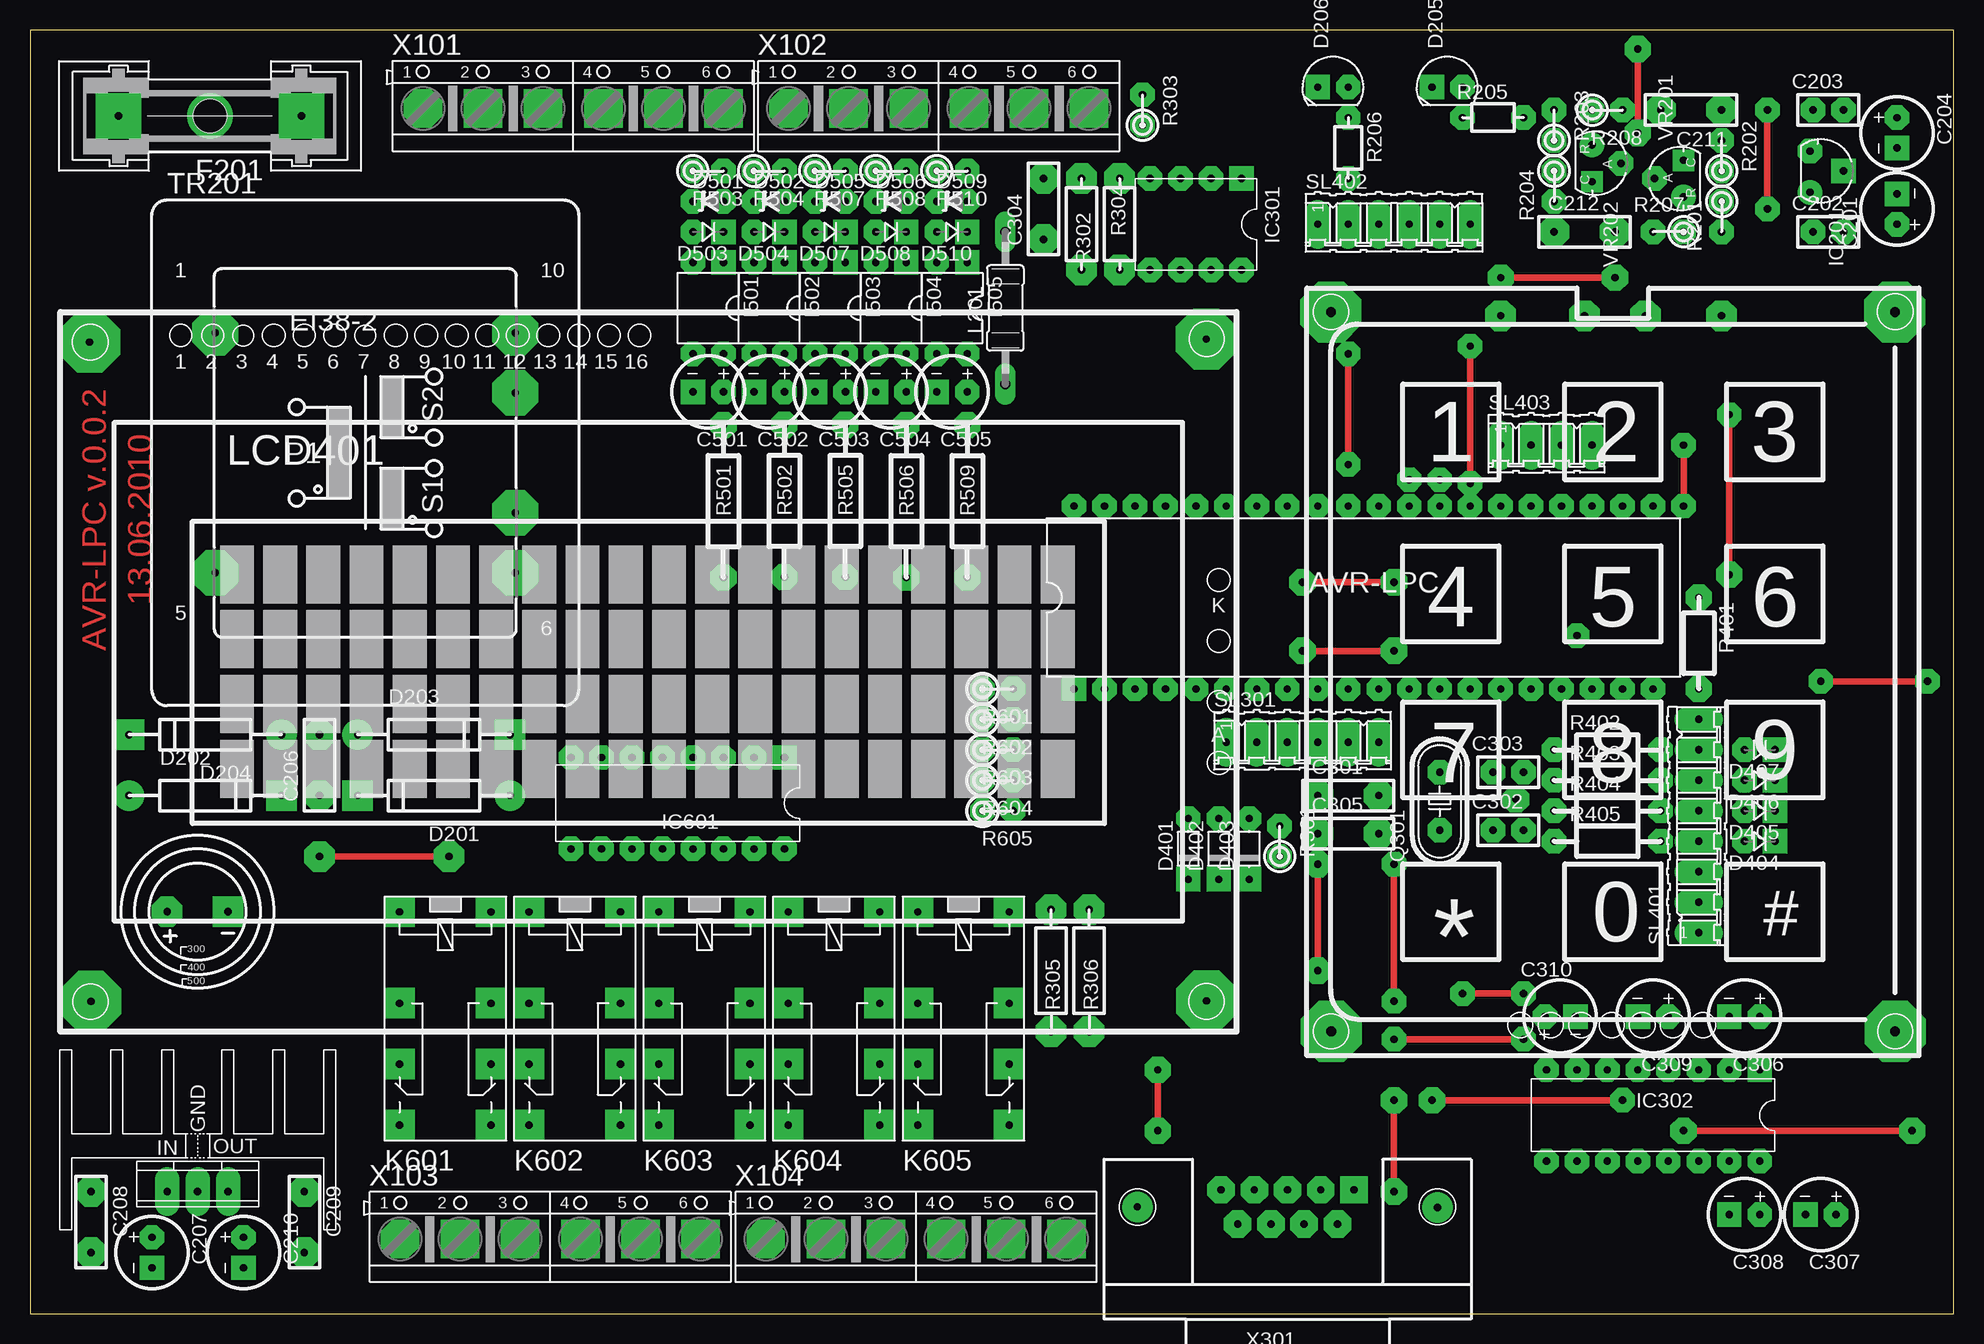
[diagram p6: board, top side]
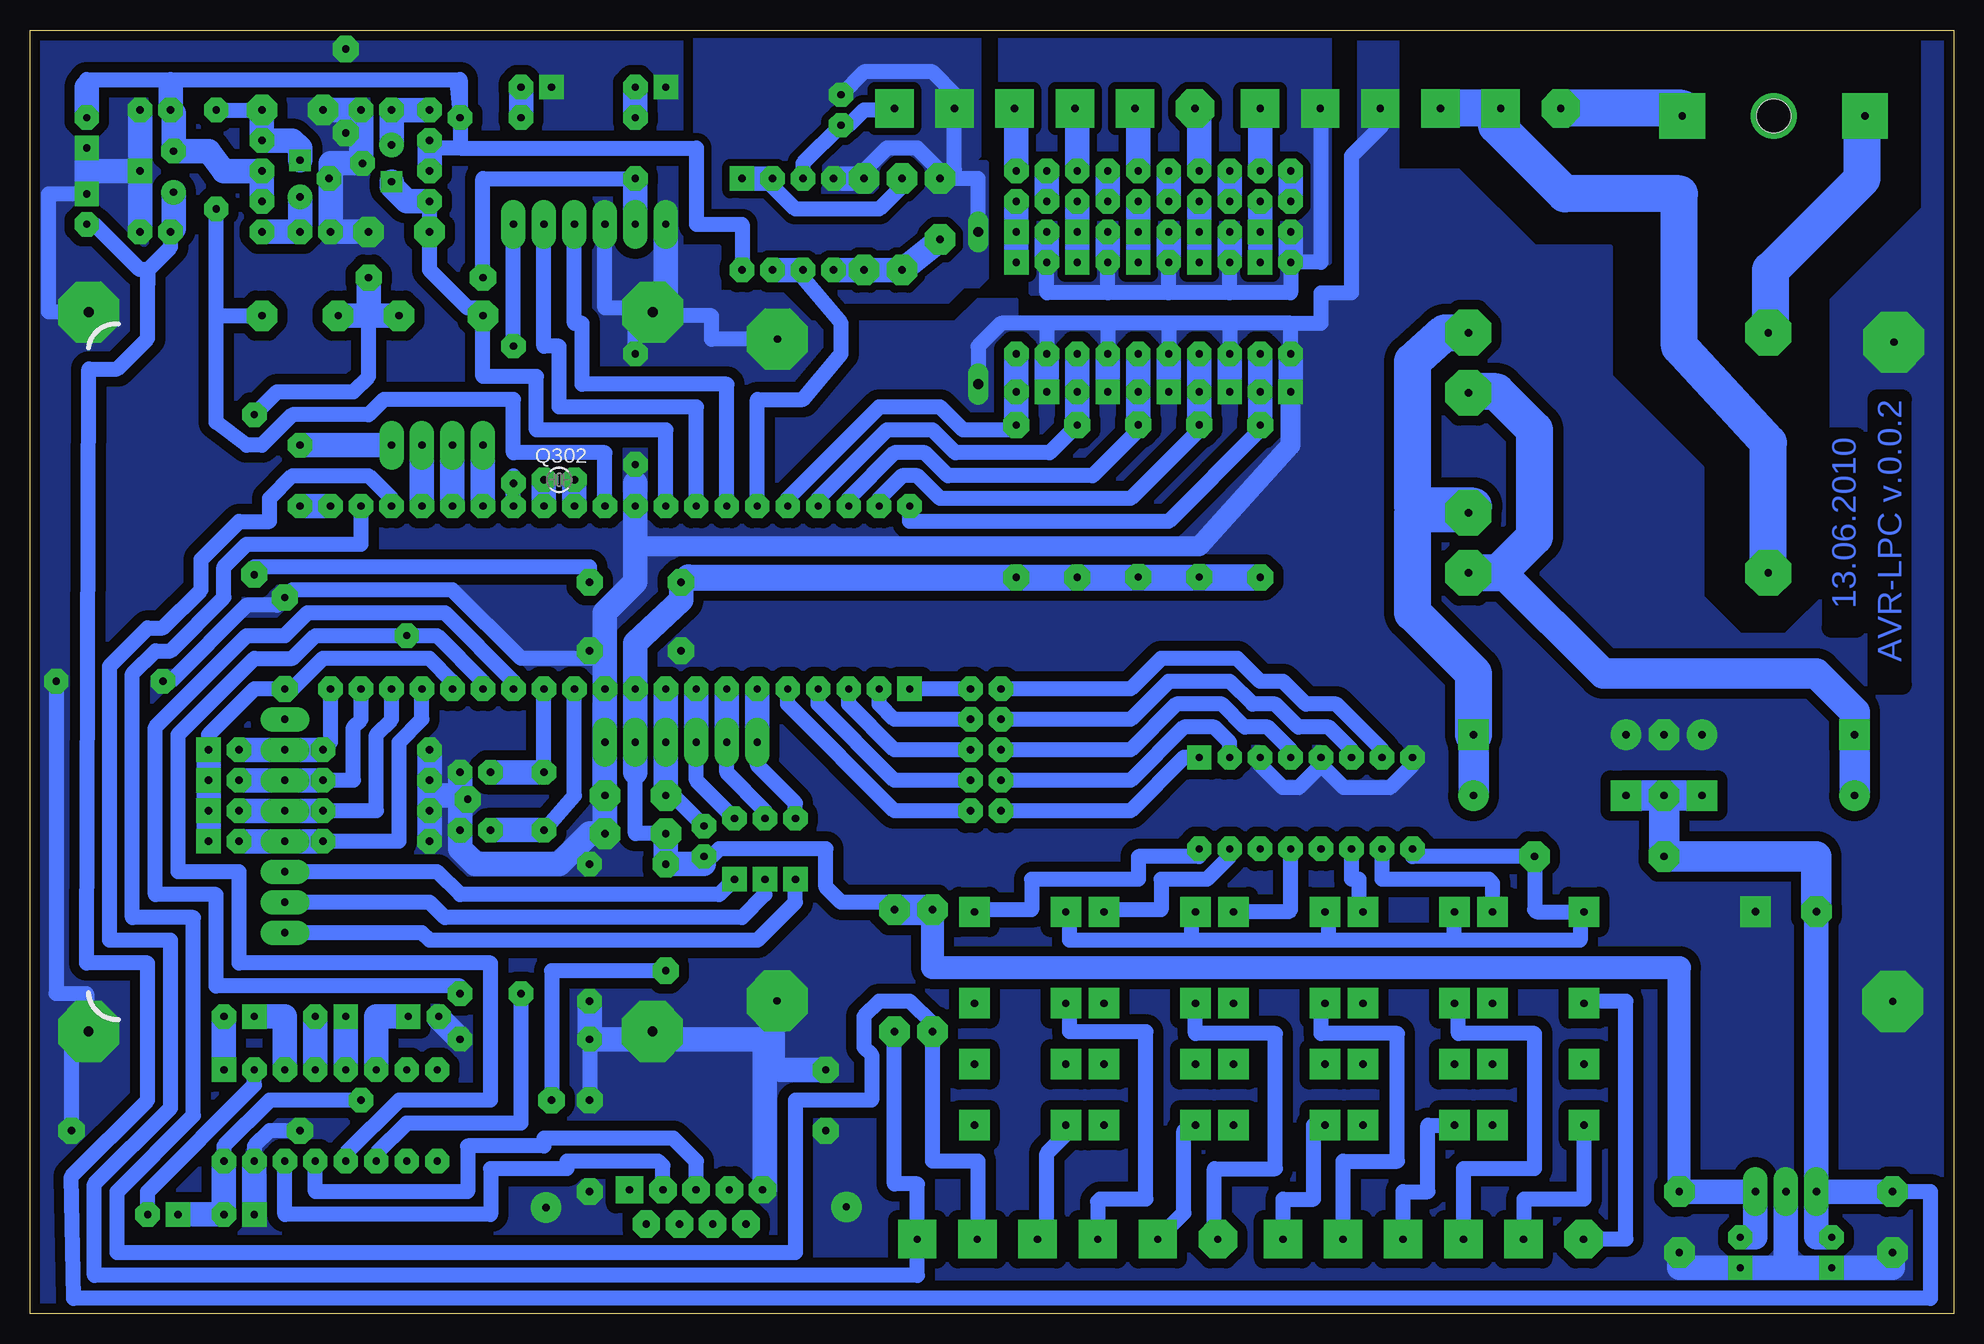
[diagram p7: board, bottom side, seen from below]

Size 160.3 x 107 mm. Coordinates in mm from the lower left corner, seen from the top.
Outline: 0,0 160.3,0 160.3,107 0.01,107 0,0
Copper layers (1*16): Top 0.035mm / dielectric 1.5mm / Bottom 0.035mm
Design rules "default *": minimum track width 50mil, minimum drill 31mil, track to track 25mil, track to pad 20mil, pad to pad 20mil, via to via 20mil, smd to smd 8mil, copper to edge 25mil, drill to drill 25mil, minimum pad ring 18mil, minimum via ring 8mil, stop-mask expansion 4mil, vias tented up to drill 0mil, thermal gap 10mil
bKeepout: 4 lines

### Footprints (pad centres in the part's own frame; a part is rotated, then mirrored left to right if it is on the bottom)
DIL40 = drill 0.61 pad 2.032 square: 1 -24.13,-7.62 | drill 0.61 pad 2.032 octagon: 2 -21.59,-7.62; 3 -19.05,-7.62; 4 -16.51,-7.62; 5 -13.97,-7.62; 6 -11.43,-7.62; 7 -8.89,-7.62; 8 -6.35,-7.62; 9 -3.81,-7.62; 10 -1.27,-7.62; 11 1.27,-7.62; 12 3.81,-7.62; 13 6.35,-7.62; 14 8.89,-7.62; 15 11.43,-7.62; 16 13.97,-7.62; 17 16.51,-7.62; 18 19.05,-7.62; 19 21.59,-7.62; 20 24.13,-7.62; 21 24.13,7.62; 22 21.59,7.62; 23 19.05,7.62; 24 16.51,7.62; 25 13.97,7.62; 26 11.43,7.62; 27 8.89,7.62; 28 6.35,7.62; 29 3.81,7.62; 30 1.27,7.62; 31 -1.27,7.62; 32 -3.81,7.62; 33 -6.35,7.62; 34 -8.89,7.62; 35 -11.43,7.62; 36 -13.97,7.62; 37 -16.51,7.62; 38 -19.05,7.62; 39 -21.59,7.62; 40 -24.13,7.62
CP100X80X24 = drill 0.61 pad 2.032 octagon: + -1.27,0 | drill 0.61 pad 2.032 square: - 1.27,0
C100X86X24 = drill 0.61 pad 2.032 octagon: P$1 -1.27,0; P$2 1.27,0
CP500/300X100X24 = drill 0.61 pad 2.54 octagon: + 2.54,0 | drill 0.61 pad 2.54 square: - -2.54,0
C200X100X24 = drill 0.61 pad 2.54 octagon: P$1 -2.54,0; P$2 2.54,0
400X100 = drill 0.61 pad 2.54 round: A -6.35,0 | drill 0.61 pad 2.54 square: C 6.35,0
SFH205 = drill 0.61 pad 2.032 octagon: A 0,-1.27 | drill 0.61 pad 2.032 square: K 0,1.27
D-5 = drill 0.61 pad 2.032 octagon: A 2.54,0 | drill 0.61 pad 2.032 square: C -2.54,0
D-2.5 = drill 0.61 pad 2.032 octagon: A 1.27,0 | drill 0.61 pad 2.032 square: C -1.27,0
ZDIO-2.5 = drill 0.61 pad 2.032 octagon: A 1.27,0; C -1.27,0
GSH15 = drill 0.61 pad 3.81 square: 1 -7.62,0; 2 7.62,0 | drill 0.61 pad 3.81 round: P$1 0,0 | hole 2.794: 0,0
DIL04 = drill 0.61 pad 2.032 square: 1 -1.27,-3.81 | drill 0.61 pad 2.032 octagon: 2 1.27,-3.81; 3 1.27,3.81; 4 -1.27,3.81
78LXX = drill 0.61 pad 2.032 square: GND 0,1.905 | drill 0.61 pad 2.032 round: IN 1.778,-0.889 | drill 0.61 pad 2.032 octagon: OUT -1.651,-0.889
78XX_VERTICAL_COOLER = drill 0.61 pad 2.032 long: GND 0,-2.54; IN -2.54,-2.54; OUT 2.54,-2.54
DIL8 = drill 0.61 pad 2.032 square: 1 -3.81,-3.81 | drill 0.61 pad 2.032 octagon: 2 -1.27,-3.81; 3 1.27,-3.81; 4 3.81,-3.81; 5 3.81,3.81; 6 1.27,3.81; 7 -1.27,3.81; 8 -3.81,3.81
DIL16 = drill 0.61 pad 2.032 square: 1 -8.89,-3.81 | drill 0.61 pad 2.032 octagon: 2 -6.35,-3.81; 3 -3.81,-3.81; 4 -1.27,-3.81; 5 1.27,-3.81; 6 3.81,-3.81; 7 6.35,-3.81; 8 8.89,-3.81; 9 8.89,3.81; 10 6.35,3.81; 11 3.81,3.81; 12 1.27,3.81; 13 -1.27,3.81; 14 -3.81,3.81; 15 -6.35,3.81; 16 -8.89,3.81
351 = drill 0.61 pad 2.54 square: 1 -3.81,-3.81; 16 -3.81,3.81; O1 8.89,-3.81; O2 8.89,3.81; P1 3.81,-3.81; P2 3.81,3.81; S1 13.97,-3.81; S2 13.97,3.81
MICC12 = drill 0.813 long: 1 -6.35,0; 2 6.35,0
HC49U-V = drill 0.61 pad 2.032 octagon: 1 -2.413,0; 2 2.413,0
TC26V = drill 0.61 pad 2.032 octagon: 1 -1.27,0; 2 1.27,0
R100X86X24 = drill 0.61 pad 2.032 octagon: P$1 -1.27,0; P$2 1.27,0
R200X86X24 = drill 0.61 pad 2.032 octagon: P$1 -2.54,0; P$2 2.54,0
R300X100X24 = drill 0.61 pad 2.54 octagon: P$1 -3.81,0; P$2 3.81,0
R400X100X24 = drill 0.61 pad 2.54 octagon: P$1 -5.08,0; P$2 5.08,0
R300X86X24 = drill 0.61 pad 2.184 octagon: P$1 -3.81,0; P$2 3.81,0
R350X86X24 = drill 0.61 pad 2.032 octagon: P$1 -4.445,0; P$2 4.445,0
R500X86X24 = drill 0.61 pad 2.184 octagon: P$1 -6.35,0; P$2 6.35,0
R100X80X24 = drill 0.61 pad 2.032 octagon: P$1 -1.27,0; P$2 1.27,0
06P = drill 0.61 pad 2.032 long: 1 -6.35,0; 2 -3.81,0; 3 -1.27,0; 4 1.27,0; 5 3.81,0; 6 6.35,0
08P = drill 0.61 pad 2.032 long: 1 -8.89,0; 2 -6.35,0; 3 -3.81,0; 4 -1.27,0; 5 1.27,0; 6 3.81,0; 7 6.35,0; 8 8.89,0
04P = drill 0.61 pad 2.032 long: 1 -3.81,0; 2 -1.27,0; 3 1.27,0; 4 3.81,0
EI38-2 = drill 0.61 pad 3.81 octagon: 1 -12.497,10.008; 5 -12.497,-10.008; 6 12.497,-10.008; 7 12.497,-5.004; 9 12.497,5.004; 10 12.497,10.008
TO92-CLP = drill 0.61 pad 2.032 octagon: A 0,2.159 | drill 0.61 pad 1.778 square: C 1.524,-0.254 | drill 0.61 pad 2.032 round: R -1.524,-0.254
AK500/6 = drill 0.61 pad 3.2 octagon: 1 -12.522,0 | drill 0.61 pad 3.2 square: 2 -7.518,0; 3 -2.515,0; 4 2.515,0; 5 7.518,0; 6 12.522,0
H3R09RA = drill 0.61 pad 2.286 square: 1 5.537,1.422 | drill 0.61 pad 2.286 octagon: 2 2.769,1.422; 3 0,1.422; 4 -2.769,1.422; 5 -5.537,1.422; 6 4.153,-1.422; 7 1.384,-1.422; 8 -1.384,-1.422; 9 -4.153,-1.422

### Placement (x,y rotation side)
AVR-LPC  111.12,59.69 0 top
C201  155.57,92.08 90 top
C202  149.86,90.17 0 top
C203  149.86,100.33 0 top
C204  155.57,98.42 270 top
C205  13.97,33.49 180 top
C206  24.13,45.72 90 top
C207  10.16,5.08 270 top
C208  5.08,7.62 270 top
C209  22.86,7.62 270 top
C210  17.78,5.08 270 top
C211  138.43,100.33 180 top
C212  129.54,90.17 0 top
C301  109.86,43.18 0 top
C302  123.19,40.3 0 top
C303  123.19,45.12 0 top
C304  84.45,92.08 90 top
C305  109.86,40.01 0 top
C306  142.88,24.77 180 top
C307  149.22,8.26 180 top
C308  142.88,8.26 180 top
C309  135.25,24.77 180 top
C310  127.51,24.77 0 top
C501  56.52,76.83 180 top
C502  61.6,76.83 180 top
C503  66.68,76.83 180 top
C504  71.76,76.83 180 top
C505  76.84,76.83 180 top
D201  33.66,43.18 180 top
D202  14.61,43.18 0 top
D203  33.66,48.26 0 top
D204  14.61,48.26 180 top
D205  118.11,102.23 90 top
D206  108.58,102.23 90 top
D401  96.52,38.73 90 top
D402  99.06,38.73 90 top
D403  101.6,38.73 90 top
D404  144.15,39.37 180 top
D405  144.15,41.91 180 top
D406  144.15,44.45 180 top
D407  144.15,46.99 180 top
D501  56.52,92.71 0 top
D502  61.59,92.71 0 top
D503  56.52,90.17 180 top
D504  61.59,90.17 180 top
D505  66.67,92.71 0 top
D506  71.75,92.71 0 top
D507  66.67,90.17 180 top
D508  71.75,90.17 180 top
D509  76.83,92.71 0 top
D510  76.83,90.17 180 top
F201  14.99,99.83 180 top
I501  56.52,83.82 180 top
I502  61.59,83.82 180 top
I503  66.67,83.82 180 top
I504  71.75,83.82 180 top
I505  76.83,83.82 180 top
IC201  149.22,95.25 270 top
IC202  13.97,12.7 0 top
IC301  97.16,90.81 180 top
IC302  135.25,16.51 180 top
IC601  53.98,42.55 180 top
K601  34.61,29.67 270 top
K602  45.41,29.67 270 top
K603  56.2,29.67 270 top
K604  67,29.67 270 top
K605  77.79,29.67 270 top
L201  81.28,83.82 90 top
LCD401  2.54,23.5 0 top
Q301  117.48,42.71 90 top
Q302  116.2,69.51 0 bottom
R201  140.97,91.44 90 top
R202  140.97,96.52 270 top
R203  127,99.06 270 top
R204  127,93.98 90 top
R205  121.92,99.69 0 top
R206  109.86,97.16 270 top
R207  136.53,90.17 0 top
R208  131.44,100.33 180 top
R301  104.14,39.37 270 top
R302  87.63,90.81 90 top
R303  92.71,100.33 270 top
R304  90.81,90.81 270 top
R305  85.09,28.57 90 top
R306  88.27,28.57 90 top
R401  139.06,55.88 270 top
R402  131.44,46.99 0 top
R403  131.44,44.45 0 top
R404  131.44,41.91 0 top
R405  131.44,39.37 0 top
R501  57.79,67.72 270 top
R502  62.87,67.74 270 top
R503  56.52,95.25 180 top
R504  61.59,95.25 180 top
R505  67.95,67.74 270 top
R506  73.03,67.72 270 top
R507  66.67,95.25 180 top
R508  71.75,95.25 180 top
R509  78.11,67.72 270 top
R510  76.83,95.25 180 top
R601  80.64,52.07 180 top
R602  80.64,49.53 180 top
R603  80.64,46.99 180 top
R604  80.64,44.45 180 top
R605  80.64,41.91 180 top
SL301  106.05,47.62 0 top
SL401  139.06,40.64 90 top
SL402  113.67,90.81 0 top
SL403  126.36,72.39 0 top
TR201  27.94,71.75 0 top
U$1  [M-3X4]  106.41,21.5 0 top
VR201  137.54,94.61 90 top
VR202  130.43,95.89 270 top
X101  45.26,100.46 0 top
X102  75.74,100.46 0 top
X103  43.36,6.2 0 top
X104  73.84,6.2 0 top
X301  104.79,8.89 0 top

### Tracks (layer width: path | path; a pad name or v marks a point on that pad's centre or on a via)
+5V  (via drill 0.61 pad 2.03, 0.61 pad 2.18, 0.61 pad 2.54)
  Top 0.559: v106.05,60.96 v113.67,60.96 | v141.6,61.59 v141.6,74.93 | v116.84,17.78 v132.72,17.78 | v107.31,37.47 v107.31,28.57 | v132.08,86.36 v122.56,86.36
  Bottom 1.27: R306.P$2 88.77,34.29 92.71,34.29 93.98,35.56 93.98,38.73 102.87,38.73 103.5,38.1 R301.P$2 | 85.09,28.83 85.09,29.21 | v113.67,60.96 113.67,62.23 141.6,62.23 v141.6,61.59 | IC302.16 144.15,13.97 140.34,17.78 v132.72,17.78 | C305.P$1 109.86,40.01 109.86,45.09 | v116.84,17.78 116.84,28.57 v107.31,28.57 | SL402.2 109.86,93.34 109.69,94.14 R206.P$2 122.56,94.61 v122.56,86.36 | v141.6,74.93 139.7,76.83 133.35,76.83 132.08,78.11 132.08,83.19
  Bottom 1.905: C209.P$1 22.86,28.83 85.09,28.83 | 85.09,29.21 R305.P$2
  Bottom 2.032: C210.+ 16.51,6.35 IC202.OUT C209.P$1 | v106.05,60.96 106.05,59.46 109.86,55.88 AVR-LPC.10 SL301.5 109.86,45.09 | IC302.16 C308.+ C307.- | R301.P$2 104.14,37.47 v107.31,37.47 C305.P$1 | R206.P$2 SL402.2 | v134.62,83.19 133.99,83.19 132.08,83.19 | 132.08,83.19 v129.54,83.19 | 132.08,83.19 v132.08,86.36
  Bottom 2.184: R506.P$2 R501.P$2 R502.P$2 | R509.P$2 R506.P$2 | R509.P$2 R505.P$2 R506.P$2 | R509.P$2 105.41,61.37 v106.05,60.96
  Bottom 2.54: R305.P$2 R306.P$2
+12V
  Bottom 1.27: 124.46,102.87 124.46,97.16 | IC301.8 100.97,90.81 104.78,90.81 104.78,97.16 124.46,97.16 | 148.59,102.87 124.46,102.87 | 148.59,102.87 148.59,102.23 | 148.59,102.87 155.57,102.87 155.57,102.23 | R205.P$2 124.74,102.59 124.46,102.87 | 124.46,97.16 127,97.16
  Bottom 2.032: R204.P$2 127,97.16 R203.P$2 | R201.P$2 R202.P$2 144.15,95.25 145.41,96.9 IC201.OUT 148.34,100.08 C203.P$1 148.59,102.23 | C204.+ 155.57,102.23
+15V  (via drill 0.61 pad 2.54)
  Top 0.559: v24.13,38.1 v34.92,38.1
  Bottom 1.27: 41.91,31.11 31.11,31.11 31.11,33.16 K601.1 34.75,33.48 34.92,33.66 v34.92,38.1 45.09,38.1 IC601.9 | 41.91,31.11 41.59,31.43 K602.1 | K603.1 52.07,33.16 52.07,31.11 | 41.91,31.11 52.07,31.11 | K604.1 63.5,33.16 63.5,31.11 | 52.07,31.11 63.5,31.11 | 73.66,33.02 73.66,33.16 K605.1 73.66,33.02 | 63.5,31.11 73.66,31.11 73.66,33.02 | IC201.IN 148.59,93.22 | C208.P$1 1.91,10.16 1.91,1.27 156.67,1.27 156.84,11.43 150.5,17.78 150.5,29.21 155.57,29.21 155.4,78.74 153.03,78.74 150.5,81.28 150.5,87 | 150.5,87 150.49,87.03 | 150.49,87.03 150.49,85.72 150.5,87 | 150.5,87 148.59,88.9 C202.P$1 | 150.49,87.03 151.16,87.03 154.94,90.81 C201.+
  Bottom 2.032: C208.P$1 IC202.IN | C207.+ 11.43,6.35 IC202.IN | IC201.IN 148.34,90.42 C202.P$1 | IC202.IN C205.+ 11.43,33.66
  Bottom 2.54: C206.P$1 D202.C | C206.P$1 D201.C | C206.P$1 v24.13,38.1 11.43,38.1 11.43,33.66
AGND
  Bottom 1.27: L201.2 81.28,94.61 83.19,94.61 | 83.19,94.61 C304.P$2 84.45,95.25 86.36,97.16 88.9,97.16 90.81,95.25 R304.P$1 | 83.19,94.61 83.26,95.33 X102.5 83.19,100.54 83.19,101.6 85.09,103.5 90.81,103.5 R303.P$1
  Bottom 2.032: R304.P$1 IC301.4
  pour Bottom (no thermals): 81.28,85.72 80.64,86.36 80.64,95.89 81.92,95.89 81.28,96.52 81.28,106.68 104.78,106.68 104.78,90.17 101.6,90.17 101.6,86.36 96.52,86.36 94.61,84.45 83.82,84.45 82.55,85.72
AI0
  Bottom 1.27: IC301.3 95.89,95.89 R303.P$2 92.08,99.06 90.81,100.33 88.4,100.33 X102.6
AIN_PUT0
  Bottom 1.27: IC301.6 95.89,86.36 92.71,82.55 92.71,80.01 95.89,76.2 99.69,76.2 AVR-LPC.35
  Bottom 2.032: IC301.6 IC301.7
AREF  (via drill 0.61 pad 2.54)
  Bottom 1.27: AVR-LPC.32 107.31,73.66 118.11,73.66 118.11,78.11 122.56,78.11 v122.56,83.19 122.56,83.82 123.83,83.82 127,87 C212.P$1 R204.P$1
  Bottom 2.032: R204.P$1 128.91,92.71 130.18,93.98 VR202.C
AVCC  (via drill 0.61 pad 2.03, 0.61 pad 2.54)
  Top 0.559: v144.78,92.08 v144.78,100.33
  Bottom 1.27: AVR-LPC.30 112.39,71.75 120.02,71.75 120.02,76.2 130.81,76.2 132.08,74.93 138.43,74.93 140.97,72.39 142.24,72.39 144.78,74.3 144.78,83.19 | 144.78,83.19 v140.97,83.19 | 144.78,83.19 v144.78,92.08 | v144.78,100.33 C211.P$1
  Bottom 2.032: VR201.C 137.79,97.16 138.43,97.79 R202.P$1 C211.P$1
COL0_ISP_MOSI
  Bottom 1.27: D401.A 96.52,42.55 99.69,45.72 SL301.1
  Bottom 2.032: SL301.1 AVR-LPC.6
COL1_ISP_MISO
  Bottom 1.27: D402.A 99.06,41.91 102.23,45.09 SL301.2
  Bottom 2.032: SL301.2 AVR-LPC.7
COL2_ISP_SCK
  Bottom 1.27: D403.A 104.78,44.45 SL301.3
  Bottom 2.032: SL301.3 AVR-LPC.8
DATA0
  Bottom 2.032: AVR-LPC.26 SL403.1
DATA1
  Bottom 2.032: AVR-LPC.25 SL403.2
DATA2
  Bottom 2.032: AVR-LPC.24 SL403.3
DATA3  (via drill 0.61 pad 2.03)
  Top 0.559: v137.79,67.31 v137.79,72.39
  Bottom 2.032: v137.79,72.39 SL403.4 | AVR-LPC.21 v137.79,67.31
EN  (via drill 0.61 pad 2.03)
  Top 0.559: v120.02,69.22 v120.02,80.64
  Bottom 1.27: AVR-LPC.27 v120.02,69.22 120.02,69.85 | v120.02,80.64 SL402.6
GND  (via drill 0.61 pad 2.03, 0.61 pad 2.18, 0.61 pad 2.54, 0.61 pad 5.08, 0.81 pad 5.08)
  Top 0.559: v156.84,15.24 v137.79,15.24 | v106.05,55.24 v113.67,55.24 | v109.86,70.78 v109.86,80.01 | v113.67,26.04 v113.67,37.47 | v113.67,22.86 v124.46,22.86 | v149.22,52.7 v158.12,52.7 | v133.99,98.42 v133.99,105.41 | v93.98,20.32 v93.98,15.24 | v113.67,17.78 v113.67,10.16
  Bottom 1.27: I501.3 55.24,82.55 | 55.24,82.55 60.33,82.55 | 60.33,82.55 I502.3 | 60.33,82.55 65.41,82.55 | 65.41,82.55 I503.3 | 65.41,82.55 70.48,82.55 | 70.48,82.55 75.56,82.55 | 75.56,82.55 I505.3 | 52.7,45.72 54.61,43.81 55.88,43.81 57.78,45.72 IC601.3 | 52.7,45.72 IC601.5 | 52.7,45.72 50.8,43.81 46.99,43.81 45.09,45.72 IC601.8 | 55.24,82.55 52.7,82.55 52.7,85.09 50.16,85.09 50.16,96.52 47.62,99.06 47.62,100.31 X101.4 | 75.56,82.55 79.38,82.55 81.28,80.64 L201.1 | 70.48,82.55 I504.3 | 112.39,54.61 119.38,54.61 125.09,60.33 138.43,60.33 R401.P$1 139.7,59.05 142.24,59.05 148.59,52.7 v149.22,52.7 | IC302.15 141.6,13.97 140.34,15.24 v137.79,15.24 | v156.84,15.24 156.84,23.5 156.83,23.51 155.57,23.51 155.57,26.67 158.12,26.67 v158.12,52.7 | SL402.3 112.39,83.82 108.41,83.82 v108.41,83.48 | 107.31,84.45 108.41,84.45 v108.41,83.48 | v98.01,81.23 103.5,81.23 103.5,83.19 108.58,83.19 | v155.41,83.48 158.75,83.48 158.75,93.34 C201.- | v109.86,80.01 109.86,82.55 108.41,82.55 v108.41,83.48 | v113.67,22.86 v113.67,17.78
  Bottom 1.651: C501.- 55.24,72.39 62.87,63.96 109.86,63.96
  Bottom 2.032: C501.- I501.3 | C502.- | I502.3 C502.- | C503.- 65.41,78.11 I503.3 | I505.3 | I505.3 C505.- | 13.97,3.81 C207.- 5.08,3.81 C208.P$2 | 13.97,3.81 C210.- 22.86,3.81 C209.P$2 | 13.97,3.81 IC202.GND | I504.3 C504.- | C504.- | IC201.GND C202.P$2 | IC201.GND C203.P$2 | 155.57,95.25 IC201.GND | C201.- 155.57,95.25 | 155.57,95.25 C204.- | 124.46,43.18 C302.P$2 124.46,38.73 123.19,37.47 116.2,37.47 113.67,40.01 C305.P$2 C301.P$2 SL301.6 AVR-LPC.11 112.39,54.61 112.39,58.42 109.86,60.96 109.86,63.96 AVR-LPC.31 109.86,69.22 | 124.46,43.18 C303.P$2 | v123.83,42.86 124.14,42.86 124.46,43.18 | C212.P$2 R207.P$1 135.25,94.49 VR201.A 135.25,94.74 135.25,95.89 VR202.A 132.72,96.01 R208.P$1 C211.P$2 | R405.P$1 R404.P$1 127,43.18 | 127,43.18 R403.P$1 R402.P$1 | 124.46,43.18 127,43.18 | IC302.15 C308.- | C310.+ 126.24,24.64 v124.46,22.86 | v113.67,26.04 v113.67,22.86 108.43,22.86 | v98.04,26.06 98.42,26.06 98.42,22.86 | 99.06,22.86 98.42,22.86 | 99.06,22.86 108.43,22.86 | 108.43,22.86 v108.43,23.51 | X301.5 99.06,10.31 99.06,22.86 | v93.98,20.32 97.79,20.32 98.42,20.95 98.42,22.86 | 107.31,84.45 SL402.1
  other vias: 155.42,23.51 4.97,80.98 5.07,26.02 92.28,8.89 117.3,8.84
  pour Bottom (isolate 0.838, no thermals): 0,0 0,106.68 2.54,106.68 2.54,92.08 10.16,84.45 10.16,60.33 13.97,56.52 17.78,56.52 20.95,59.69 20.95,70.48 28.57,78.11 28.57,88.9 34.92,88.9 41.27,95.25 46.35,95.25 46.35,106.68 49.53,106.68 49.53,85.09 52.7,85.09 52.7,82.55 78.11,82.55 78.11,84.45 81.28,84.45 83.19,82.55 95.25,82.55 97.79,85.09 102.87,85.09 102.87,88.9 106.05,88.9 106.05,106.68 160.02,106.68 160.02,0
GNDI
  Bottom 1.27: 60.33,85.09 55.24,85.09 I501.2 52.7,87.63 52.7,99.69 52.78,99.77 X101.5 | 60.33,85.09 I502.2 | 60.33,85.09 65.41,85.09 | 65.41,85.09 I503.2 | 65.41,85.09 70.48,85.09 | 70.48,85.09 75.56,85.09 I505.2 | 70.48,85.09 I504.2
  Bottom 2.032: I505.2 D510.A | I501.2 D503.A | I502.2 D504.A | I504.2 D508.A | I503.2 D507.A
  pour Bottom (isolate 0.635, no thermals): 52.07,87.63 52.07,106.68 79.38,106.68 79.38,97.16 78.74,97.16 78.74,86.36 76.83,86.36 76.83,85.09 55.24,85.09 55.24,87.63
I0
  Bottom 2.032: R503.P$1 X101.6
I1
  Bottom 2.032: R504.P$1 62.87,100.33 63.09,100.33 X102.1
I2
  Bottom 2.032: R507.P$1 67.94,100.33 68.09,100.33 X102.2
I3
  Bottom 2.032: R508.P$1 73.03,100.26 X102.3
I4
  Bottom 2.032: R510.P$1 78.11,100.31 X102.4
IN_PUT0
  Bottom 1.27: AVR-LPC.40 87,66.04 65.41,66.04 58.01,73.43 | R501.P$1 57.78,73.66 58.01,73.43 | 58.01,73.43 58.01,74.07
  Bottom 2.032: C501.+ I501.4 | C501.+ | R501.P$1 C501.+
IN_PUT1
  Bottom 1.27: AVR-LPC.39 89.53,67.94 87.63,69.85 86.36,69.85 84.45,67.94 68.58,67.94 62.87,73.66 R502.P$1
  Bottom 2.032: R502.P$1 C502.+ | C502.+ | C502.+ I502.4
IN_PUT2
  Bottom 1.27: R505.P$1 67.94,73.66 71.75,69.85 83.82,69.85 85.72,71.75 88.27,71.75 92.08,67.94 AVR-LPC.38
  Bottom 2.032: I503.4 | I503.4 C503.+ R505.P$1
IN_PUT3
  Bottom 1.27: AVR-LPC.37 94.61,67.94 88.9,73.66 85.09,73.66 83.19,71.75 75.34,71.75 R506.P$1
  Bottom 2.032: I504.4 73.03,78.74 C504.+ R506.P$1
IN_PUT4
  Bottom 1.27: 78.11,74.3 78.11,73.66 82.55,73.66 84.45,75.56 89.53,75.56 97.16,67.94 AVR-LPC.36
  Bottom 2.032: C505.+ I505.4 | C505.+ | C505.+ 78.11,74.3 R509.P$1
ISP_RESET
  Bottom 1.27: C301.P$1 106.68,43.18 R301.P$1
  Bottom 2.032: C301.P$1 SL301.4 107.31,51.44 AVR-LPC.9
KB_INT
  Bottom 1.27: AVR-LPC.16 125.09,52.7 127,54.61 135.89,54.61 138.43,52.07 R401.P$2 141.6,52.07 145.41,48.26 D407.C
  Bottom 2.032: D404.C D405.C D406.C D407.C
L
  Bottom 3.099: X101.1 22.61,100.46 F201.1
LPC_RXD  (via drill 0.61 pad 2.03)
  Bottom 1.27: AVR-LPC.15 122.56,52.7 126.36,56.52 v128.91,56.52 136.53,56.52 138.43,54.61 141.6,54.61 147.96,48.26 147.96,36.83 142.88,36.83 142.88,29.21 121.92,29.21 121.92,17.78 129.54,17.78 133.99,13.34 IC302.12
LPC_TXD  (via drill 0.61 pad 2.03)
  Top 0.559: v119.38,26.67 v124.46,26.67
  Bottom 1.27: AVR-LPC.14 120.02,52.7 125.73,58.42 137.16,58.42 139.06,56.52 142.24,56.52 149.86,48.9 149.86,34.92 144.78,34.92 144.78,27.3 124.46,27.3 v124.46,26.67 | IC302.11 131.44,13.34 128.91,15.88 119.38,15.88 v119.38,26.67
N
  Bottom 2.54: 38.46,100.46 38.1,99.47 X101.2
  Bottom 3.099: TR201.5 15.44,72.59 22.86,80.64 22.86,93.34 32.38,93.34 38.1,99.06 38.1,99.47 | 38.46,100.46 X101.3
N$1
  Bottom 3.099: TR201.1 15.24,81.76 15.24,87 7.62,94.61 7.62,99.58 F201.2
N$3
  Bottom 2.032: VR201.R R207.P$2 R201.P$1
N$4
  Bottom 2.032: IC302.3 139.06,24.77 C306.-
N$5
  Bottom 2.54: D202.A D204.C 8.26,50.16 11.43,53.34 29.21,53.34 37.78,61.91
  Bottom 3.099: TR201.6 37.95,61.75 37.78,61.91 34.92,64.77 34.92,73.66 38.1,76.83 40.36,76.83 TR201.9
N$6
  Bottom 2.54: D201.A D203.C
  Bottom 3.099: TR201.10 42.39,81.76 45.09,79.38 45.09,67.31 40.01,67.31 40.44,66.88 TR201.7 40.56,66.75 40.64,66.67 45.09,66.67 45.09,58.42 40.01,53.34 D203.C
N$7
  Bottom 2.032: VR202.R R208.P$2 R203.P$1
N$9
  Bottom 2.032: IC302.1 C306.+
N$10
  Bottom 1.27: AVR-LPC.12 114.94,43.18 117.13,40.64 Q301.1
  Bottom 2.032: Q301.1 C302.P$1
N$11
  Bottom 1.27: Q301.2 AVR-LPC.13
  Bottom 2.032: AVR-LPC.13 | Q301.2 C303.P$1
N$12
  Bottom 2.032: IC302.5 C309.-
N$13
  Bottom 2.032: IC302.4 C309.+
N$14
  Bottom 1.27: IC302.2 141.6,19.05 150.5,10.16 C307.+
N$15
  Bottom 2.032: AVR-LPC.28 Q302.1
N$16
  Bottom 2.032: AVR-LPC.29 Q302.2
N$17
  Bottom 2.032: C304.P$1 R302.P$1 R304.P$2 IC301.5
N$19
  Bottom 2.032: IC302.6 131.44,24.77 C310.-
N$20
  Bottom 2.032: R205.P$1 D205.A
N$22
  Bottom 2.032: D501.C R503.P$2
N$23
  Bottom 2.032: I501.1 D503.C D501.A
N$24
  Bottom 1.27: SL401.1 127.64,31.75 127,31.11 99.69,31.11 96.52,34.29 D401.C
N$25
  Bottom 1.27: D402.C 99.06,34.92 100.97,33.02 125.73,33.02 127,34.29 SL401.2
N$26
  Bottom 2.032: D505.C R507.P$2
N$27
  Bottom 2.032: I503.1 D507.C D505.A
N$28
  Bottom 1.27: SL401.3 126.36,36.83 124.46,34.92 102.87,34.92 D403.C
N$29
  Bottom 1.27: R302.P$2 87.63,93.98 89.53,92.08 96.52,92.08 99.06,94.61
  Bottom 2.032: IC301.2 99.06,94.61 IC301.1
N$34
  Bottom 2.032: R206.P$1 D206.A
N$39
  Bottom 2.032: D509.C R510.P$2
N$40
  Bottom 2.032: I505.1 D510.C D509.A
N$43
  Bottom 2.032: D502.C R504.P$2
N$44
  Bottom 2.032: I502.1 D504.C D502.A
N$51
  Bottom 2.032: D506.C R508.P$2
N$52
  Bottom 2.032: I504.1 D508.C D506.A
OUT_PUT0
  Bottom 1.27: R601.P$1 AVR-LPC.1
OUT_PUT1
  Bottom 1.27: R602.P$1 88.27,49.53 89.53,50.8 AVR-LPC.2
OUT_PUT2
  Bottom 1.27: R603.P$1 88.27,46.99 92.08,50.8 AVR-LPC.3
OUT_PUT3
  Bottom 1.27: R604.P$1 88.27,44.45 94.61,50.8 AVR-LPC.4
OUT_PUT4
  Bottom 1.27: R605.P$1 88.27,41.91 97.16,50.8 AVR-LPC.5
Q0
  Bottom 1.27: X103.1 27.3,6.2 27.3,26.04 30.8,26.04 K601.P1
Q1
  Bottom 1.27: X103.2 35.81,6.45 35.81,9.53 30.8,9.53 K601.S1
Q2
  Bottom 1.27: K602.P1 41.27,25.86 41.27,23.34 34.92,23.34 34.92,12.06 40.84,12.06 X103.3
Q3
  Bottom 1.27: K602.S1 43.81,15.7 43.81,10.16 45.87,10.16 X103.4
Q4
  Bottom 1.27: K603.P1 52.7,25.86 52.7,23.34 46.35,23.34 46.35,12.7 50.88,12.7 X103.5
Q5
  Bottom 1.27: K603.S1 53.34,15.7 53.34,9.53 55.88,9.53 X103.6
Q6
  Bottom 1.27: X104.1 61.59,6.45 61.59,12.06 56.52,12.06 56.52,23.34 63.19,23.34 K604.P1
Q7
  Bottom 1.27: X104.2 64.14,8.38 64.14,15.24 63.67,15.7 K604.S1
Q8
  Bottom 1.27: K605.P1 73.66,25.54 73.66,23.5 67.31,23.5 67.31,9.53 71.12,9.53 71.32,9.32 X104.3
Q9
  Bottom 1.27: X104.4 76.2,6.35 75.56,6.35 75.56,13.34 73.98,14.92 K605.S1
R/W
  Bottom 1.27: AVR-LPC.33 104.78,75.56 116.2,75.56 116.2,80.64 117.47,80.64 SL402.5
RD0
  Bottom 1.27: IC601.7 47.62,46.99 51.44,50.8 53.98,50.8 55.88,52.7 57.78,52.7 59.69,54.61 66.04,54.61 68.58,52.07 R601.P$2
RD1
  Bottom 1.27: IC601.6 50.16,46.99 52.07,48.9 54.61,48.9 56.52,50.8 58.42,50.8 60.33,52.7 65.41,52.7 68.58,49.53 R602.P$2
RD2
  Bottom 1.27: IC601.4 55.24,46.99 57.15,48.9 59.05,48.9 60.96,50.8 64.77,50.8 68.58,46.99 R603.P$2
RD3
  Bottom 1.27: IC601.2 60.33,47.62 61.59,48.9 64.14,48.9 68.58,44.45 R604.P$2
RD4
  Bottom 1.27: IC601.1 64.14,46.35 68.58,41.91 R605.P$2
RECIVE_FROM_PC
  Bottom 1.27: IC302.13 136.53,10.16 123.83,10.16 123.83,13.97 117.47,13.97 117.47,14.61 106.68,14.61 104.78,12.7 104.79,11.45 X301.3
RELAY0
  Bottom 1.27: IC601.10 47.62,36.2 38.73,36.2 38.42,35.88 K601.16
RELAY1
  Bottom 1.27: K602.16 49.53,33.8 49.53,36.2 50.16,36.2 IC601.11
RELAY2
  Bottom 1.27: IC601.13 55.24,33.66 55.42,33.48 K603.16
RELAY3
  Bottom 1.27: IC601.15 60.33,38.1 62.23,36.2 66.04,36.2 66.04,33.66 69.85,33.66 K604.16
RELAY4
  Bottom 1.27: IC601.16 62.87,38.1 67.94,38.1 67.94,36.2 76.83,36.2 76.83,33.66 81.28,33.66 K605.16
ROW0
  Bottom 1.27: R405.P$2 129.54,39.37 129.54,47.62 127.64,49.53 AVR-LPC.17
  Bottom 2.032: R405.P$2 SL401.4 D404.A
ROW1
  Bottom 1.27: R404.P$2 131.44,41.91 131.44,48.26 130.18,49.53 AVR-LPC.18
  Bottom 2.032: R404.P$2 SL401.5 D405.A
ROW2
  Bottom 1.27: R403.P$2 133.35,44.45 133.35,48.9 132.72,49.53 AVR-LPC.19
  Bottom 2.032: R403.P$2 SL401.6 D406.A
ROW3
  Bottom 1.27: R402.P$2 135.25,47.62 AVR-LPC.20
  Bottom 2.032: R402.P$2 SL401.7 D407.A
RS
  Bottom 1.27: AVR-LPC.34 102.23,77.47 114.3,77.47 114.3,82.55 114.94,82.55 SL402.4
SCL
  Bottom 1.27: X104.5 81.28,6.27 81.28,12.7 85.09,12.7 R305.P$1 85.09,24.13 87,26.04 89.53,26.04 90.81,24.77 90.81,22.23 90.17,21.59 90.17,17.78 96.52,17.78 96.52,5.08 153.03,5.08 153.03,10.16 146.69,16.51 146.69,33.02 151.76,33.02 151.76,53.34 149.86,55.24 148.59,55.24 144.15,59.69 144.15,62.23 142.24,64.14 132.72,64.14 AVR-LPC.22
SDA
  Bottom 1.27: AVR-LPC.23 130.18,67.94 132.08,69.85 138.43,69.85 140.34,67.94 140.34,66.04 142.88,66.04 146.05,62.87 146.05,60.33 149.22,57.15 150.5,57.15 153.67,53.98 153.67,31.11 148.59,31.11 148.59,17.14 154.94,10.79 154.94,3.17 86.36,3.17 X104.6 86.36,10.79 88.27,10.79 R306.P$1
SEND_TO_PC
  Bottom 1.27: IC302.14 139.06,8.26 121.92,8.26 121.92,12.06 115.57,12.06 115.57,12.7 107.95,12.7 107.56,12.31 X301.2

### Text on the board
Top: 13.06.2010 | AVR-LPC v.0.0.2
Bottom: AVR-LPC v.0.0.2 | 13.06.2010